# EAGLE design tmc5160_step (EAGLE 6.4)

## Sheet 1 of 5
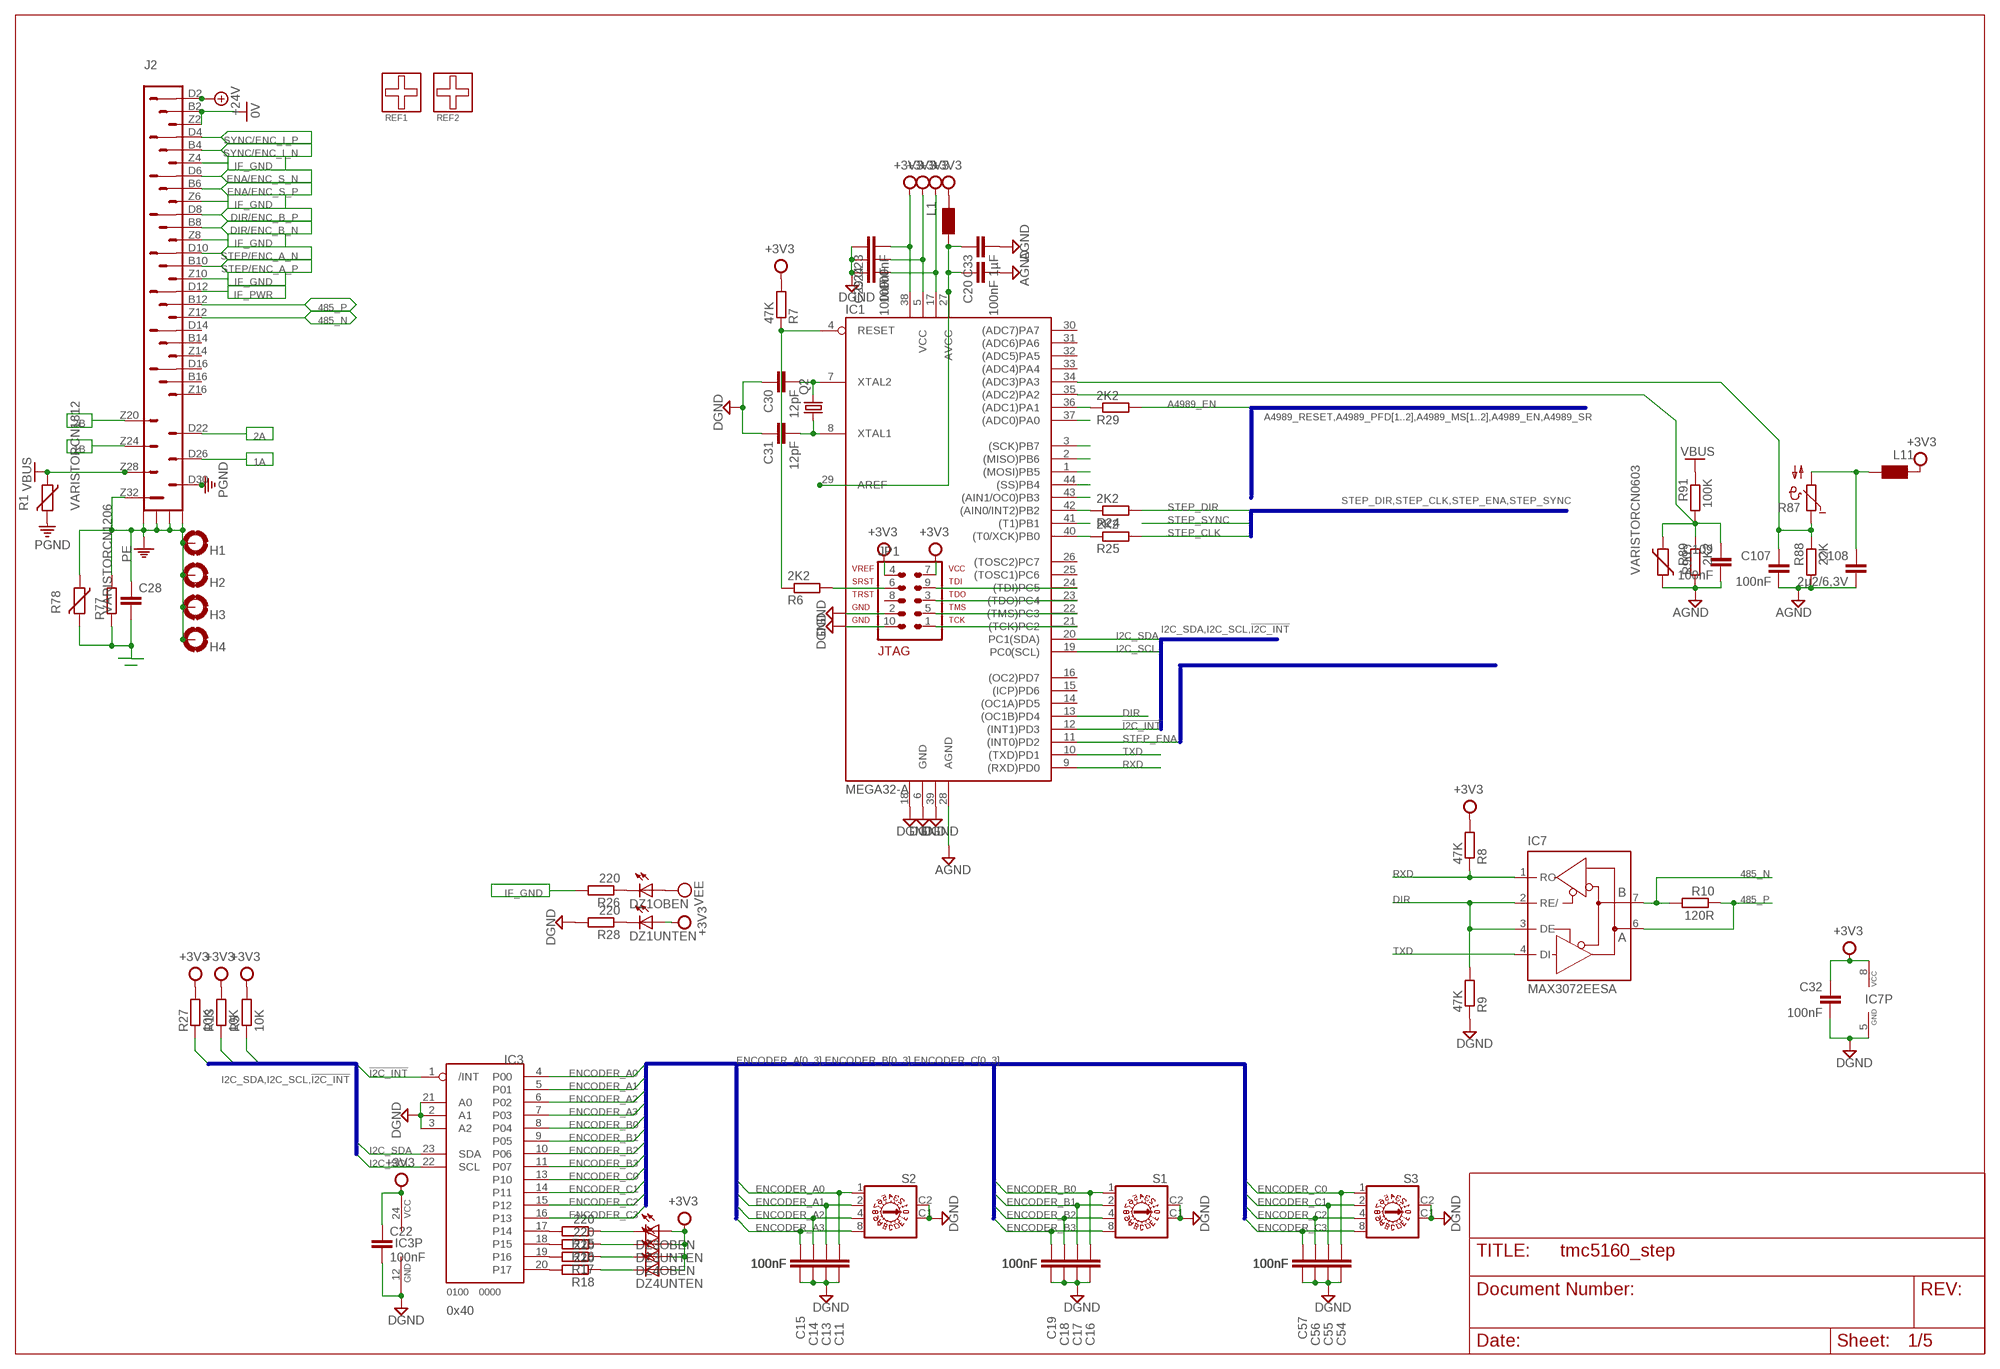
[diagram p0: schematic, sheet 1]

### Parts
C11  100nF  C-EUC0603  [C0603]
C13  100nF  C-EUC0603  [C0603]
C14  100nF  C-EUC0603  [C0603]
C15  100nF  C-EUC0603  [C0603]
C16  100nF  C-EUC0603  [C0603]
C17  100nF  C-EUC0603  [C0603]
C18  100nF  C-EUC0603  [C0603]
C19  100nF  C-EUC0603  [C0603]
C20  100nF  C-EUC0603  [C0603]
C22  100nF  C-EUC0603  [C0603]
C23  100nF  C-EUC0603  [C0603]
C24  100nF  C-EUC0603  [C0603]
C28  C-EUC1812  [C1812]
C29  100nF  C-EUC0603  [C0603]
C30  12pF  C-EUC0603  [C0603]
C31  12pF  C-EUC0603  [C0603]
C32  100nF  C-EUC0603  [C0603]
C33  1µF  C-EUC0603  [C0603]
C54  100nF  C-EUC0603  [C0603]
C55  100nF  C-EUC0603  [C0603]
C56  100nF  C-EUC0603  [C0603]
C57  100nF  C-EUC0603  [C0603]
C107  100nF  C-EUC0603  [C0603]
C108  2µ2/6,3V  C-EUC0603  [C0603]
C109  100nF  C-EUC0603  [C0603]
DZ1  18011801  [1801]
DZ3  18011801  [1801]
DZ4  18011801  [1801]
H1  MOUNT-PAD-ROUND2,5  [2,5-PAD]
H2  MOUNT-PAD-ROUND2,5  [2,5-PAD]
H3  MOUNT-PAD-ROUND2,5  [2,5-PAD]
H4  MOUNT-PAD-ROUND2,5  [2,5-PAD]
IC1  MEGA32-A  [TQFP44]
IC3  PCF8575  [MSSOP24]
IC7  MAX3072EESA  MAX481CSA  [SO08]
J2  H7/24L  [H7/24L_EK_FP]
JP1  AVR-JTAG-10-R  [AVR-JTAG-10R]
L1  WE-CBF_0805  [0805]
L11  WE-CBF_0805  [0805]
Q2  CRYSTALHC49S  [HC49/S]
R1  VARISTORCN1812  [CT/CN1812]
R5  10K  R-EU_R0603  [R0603]
R6  2K2  R-EU_R0603  [R0603]
R7  47K  R-EU_R0603  [R0603]
R8  47K  R-EU_R0603  [R0603]
R9  47K  R-EU_R0603  [R0603]
R10  120R  R-EU_R0603  [R0603]
R13  10K  R-EU_R0603  [R0603]
R15  220  R-EU_R0603  [R0603]
R16  220  R-EU_R0603  [R0603]
R17  220  R-EU_R0603  [R0603]
R18  220  R-EU_R0603  [R0603]
R24  2K2  R-EU_R0603  [R0603]
R25  2K2  R-EU_R0603  [R0603]
R26  220  R-EU_R0603  [R0603]
R27  10K  R-EU_R0603  [R0603]
R28  220  R-EU_R0603  [R0603]
R29  2K2  R-EU_R0603  [R0603]
R77  R-EU_R1206  [R1206]
R78  VARISTORCN1206  [CT/CN1206]
R87  NTC642-6  [P642]
R88  22K  R-EU_R0603  [R0603]
R89  2K2  R-EU_R0603  [R0603]
R90  VARISTORCN0603  [CT/CN0603]
R91  100K  R-EU_R0603  [R0603]
REF1  FIDUCIAL_REF-DRUCK  [REF-DRUCK]
REF2  FIDUCIAL_REF-DRUCK  [REF-DRUCK]
S1  COPAL_HEX  [COPAL_HEX]
S2  COPAL_HEX  [COPAL_HEX]
S3  COPAL_HEX  [COPAL_HEX]

### Nets
0V: J2.B2 J2.Z2 ; also sheet 2
1A: J2.D26 ; also sheet 3
1B: J2.Z24 ; also sheet 3
2A: J2.D22 ; also sheet 3
2B: J2.Z20 ; also sheet 3
485_N [diff]: IC7.7(B) J2.Z12 R10.2
485_P [diff]: IC7.6(A) J2.B12 R10.1
!I2C_INT: IC1.12((INT1)PD3) IC3.1(/INT) R5.1
+3V3: C22.1 C23.2 C24.2 C29.2 C32.1 DZ1.UA(UNTEN:A) DZ3.OA(OBEN:A) DZ3.UA(UNTEN:A) DZ4.OA(OBEN:A) DZ4.UA(UNTEN:A) IC1.5(VCC) IC1.17(VCC1) IC1.38(VCC2) IC3.24(VCC) IC7.8(VCC) JP1.4 JP1.7 L1.1 L11.1 R5.2 R7.2 R8.2 R13.2 R27.2 ; also sheet 2,3,4,5
+24V: J2.D2 ; also sheet 2
A4989_EN: R29.2 ; also sheet 3
AGND: C20.2 C33.2 C107.2 C108.2 C109.2 IC1.28(AGND) R88.2 R89.2 R90.2 ; also sheet 2
DGND: C11.1 C13.1 C14.1 C15.1 C16.1 C17.1 C18.1 C19.1 C22.2 C23.1 C24.1 C29.1 C30.1 C31.1 C32.2 C54.1 C55.1 C56.1 C57.1 IC1.6(GND) IC1.18(GND1) IC1.39(GND2) IC3.2(A1) IC3.3(A2) IC3.12(GND) IC3.21(A0) IC7.5(GND) JP1.2 JP1.10 R9.1 R28.2 S1.C1 S1.C2 S2.C1 S2.C2 S3.C1 S3.C2 ; also sheet 2,3,4,5
DIR: IC1.13((OC1B)PD4) IC7.2(RE/) IC7.3(DE) R9.2
DIR/ENC_B_N [diff]: J2.B8 ; also sheet 4
DIR/ENC_B_P [diff]: J2.D8 ; also sheet 4
ENA/ENC_S_N [diff]: J2.D6 ; also sheet 4
ENA/ENC_S_P [diff]: J2.B6 ; also sheet 4
ENCODER_A0: C11.2 IC3.4(P00) S2.1
ENCODER_A1: C13.2 IC3.5(P01) S2.2
ENCODER_A2: C14.2 IC3.6(P02) S2.4
ENCODER_A3: C15.2 IC3.7(P03) S2.8
ENCODER_B0: C16.2 IC3.8(P04) S1.1
ENCODER_B1: C17.2 IC3.9(P05) S1.2
ENCODER_B2: C18.2 IC3.10(P06) S1.4
ENCODER_B3: C19.2 IC3.11(P07) S1.8
ENCODER_C0: C54.2 IC3.13(P10) S3.1
ENCODER_C1: C55.2 IC3.14(P11) S3.2
ENCODER_C2: C56.2 IC3.15(P12) S3.4
ENCODER_C3: C57.2 IC3.16(P13) S3.8
I2C_SCL: IC1.19(PC0(SCL)) IC3.22(SCL) R27.1
I2C_SDA: IC1.20(PC1(SDA)) IC3.23(SDA) R13.1
IF_GND: J2.Z4 J2.Z6 J2.Z8 J2.Z10 R26.2 ; also sheet 4
IF_PWR: J2.D12 ; also sheet 4
N$13: JP1.6 R6.2
N$14: IC1.4(RESET) R6.1 R7.1
N$15: C107.1 IC1.34((ADC3)PA3) R87.1 R88.1
N$16: IC1.21((TCK)PC2) JP1.1
N$17: IC1.22((TMS)PC3) JP1.5
N$18: IC1.23((TDO)PC4) JP1.3
N$19: IC1.24((TDI)PC5) JP1.9
N$20: C20.1 C33.1 IC1.27(AVCC) IC1.29(AREF) L1.2
N$23: C30.2 IC1.7(XTAL2) Q2.2
N$24: C31.2 IC1.8(XTAL1) Q2.1
N$26: DZ3.OK(OBEN:C) R15.1
N$27: DZ3.UK(UNTEN:C) R16.1
N$28: DZ4.OK(OBEN:C) R17.1
N$29: DZ4.UK(UNTEN:C) R18.1
N$30: IC3.17(P14) R15.2
N$31: IC3.18(P15) R16.2
N$32: IC3.19(P16) R17.2
N$33: IC3.20(P17) R18.2
N$42: IC1.43((AIN1/OC0)PB3)
N$45: IC1.3((SCK)PB7)
N$46: IC1.1((MOSI)PB5)
N$49: IC1.44((SS)PB4)
N$50: IC1.2((MISO)PB6)
N$51: IC1.41((T1)PB1)
N$52: IC1.42((AIN0/INT2)PB2) R24.1
N$56: IC1.40((T0/XCK)PB0) R25.1
N$57: DZ1.OK(OBEN:C) R26.1
N$60: DZ1.UK(UNTEN:C) R28.1
N$61: IC1.36((ADC1)PA1) R29.1
N$62: IC1.37((ADC0)PA0)
N$82: C108.1 L11.2 R87.2
N$87: C109.1 IC1.35((ADC2)PA2) R89.1 R90.1 R91.2
PE: C28.1 H1.B2,5(MOUNT) H2.B2,5(MOUNT) H3.B2,5(MOUNT) H4.B2,5(MOUNT) J2.S1 J2.S2 J2.S3 J2.S4 J2.Z32 R77.2 R78.1 ; also sheet 4
PGND: J2.D30 R1.2 ; also sheet 3
RXD: IC1.9((RXD)PD0) IC7.1(RO) R8.1
SGND: C28.2 R77.1 R78.2 ; also sheet 2
STEP/ENC_A_N [diff]: J2.D10 ; also sheet 4
STEP/ENC_A_P [diff]: J2.B10 ; also sheet 4
STEP_CLK: R25.2 ; also sheet 3,4
STEP_DIR: R24.2 ; also sheet 3,4
STEP_ENA: IC1.11((INT0)PD2) ; also sheet 4
SYNC/ENC_I_N [diff]: J2.B4 ; also sheet 4
SYNC/ENC_I_P [diff]: J2.D4 ; also sheet 4
TXD: IC1.10((TXD)PD1) IC7.4(DI)
VBUS: J2.Z28 R1.1 R91.1 ; also sheet 3
VEE: DZ1.OA(OBEN:A) ; also sheet 4
Unconnected: IC1.14((OC1A)PD5) IC1.15((ICP)PD6) IC1.16((OC2)PD7) IC1.25((TOSC1)PC6) IC1.26((TOSC2)PC7) IC1.30((ADC7)PA7) IC1.31((ADC6)PA6) IC1.32((ADC5)PA5) IC1.33((ADC4)PA4) J2.B14 J2.B16 J2.D14 J2.D16 J2.Z14 J2.Z16 JP1.8 REF1.P$1 REF2.P$1

### Buses
ENCODER_A[0..3],ENCODER_B[0..3],ENCODER_C[0..3]
I2C_SDA,I2C_SCL,!I2C_INT
A4989_RESET,A4989_PFD[1..2],A4989_MS[1..2],A4989_EN,A4989_SR
STEP_DIR,STEP_CLK,STEP_ENA,STEP_SYNC

### Notes on the sheet
- 0100 | 0000
- 0x40

## Sheet 2 of 5
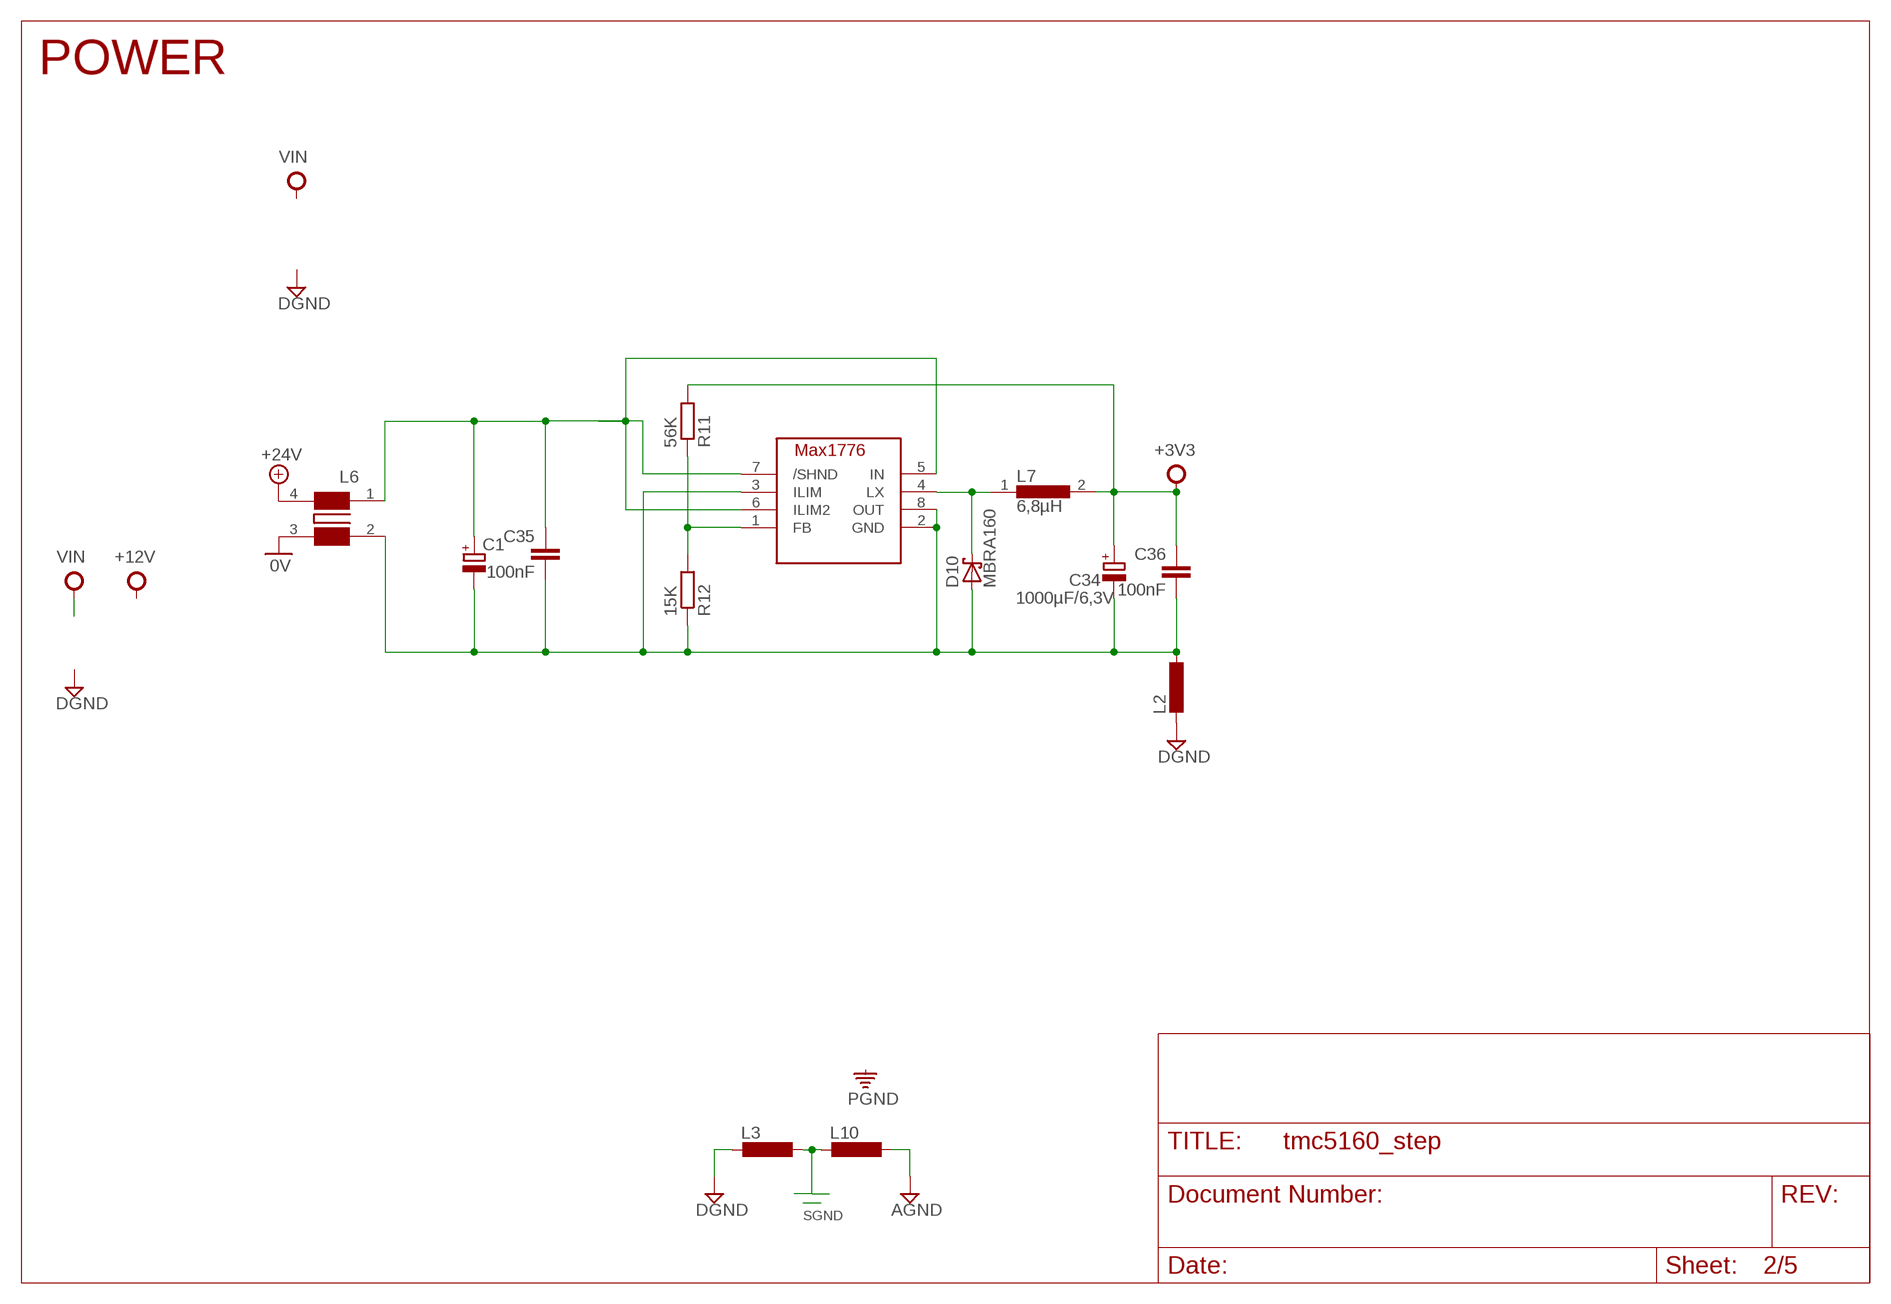
[diagram p1: schematic, sheet 2]

### Parts
C1  CPOL-EUE3.5-8  [E3,5-8]
C34  1000µF/6,3V  CPOL-EUE3.5-8  [E3,5-8]
C35  100nF  C-EUC0603  [C0603]
C36  100nF  C-EUC0603  [C0603]
D10  MBRA160  SCHOTTKY-DIODESMD  [SMB]
IC8  MAX1776  [UMAX8]
L2  L-EUL2825P  [L2825P]
L3  L-EUL2825P  [L2825P]
L6  WE-CMS  [WE-CMS_7427521]
L7  6,8µH  B82464-G4-03-5976B82472  [B82472]
L10  L-EUL2825P  [L2825P]
R11  56K  R-EU_R0603  [R0603]
R12  15K  R-EU_R0603  [R0603]

### Nets
0V: L6.3 ; also sheet 1
+3V3: C34.+ C36.1 L7.2 R11.2 ; also sheet 1,3,4,5
+24V: L6.4 ; also sheet 1
AGND: L10.1 ; also sheet 1
DGND: L2.2 L3.2 ; also sheet 1,3,4,5
N$40: D10.C IC8.4(LX) L7.1
N$41: IC8.1(FB) R11.1 R12.2
N$63: C1.+ C35.1 IC8.5(IN) IC8.6(ILIM2) IC8.7(/SHND) L6.1
N$64: C1.- C34.- C35.2 C36.2 D10.A IC8.2(GND) IC8.3(ILIM) IC8.8(OUT) L2.1 L6.2 R12.1
SGND: L3.1 L10.2 ; also sheet 1

### Notes on the sheet
- POWER

## Sheet 3 of 5
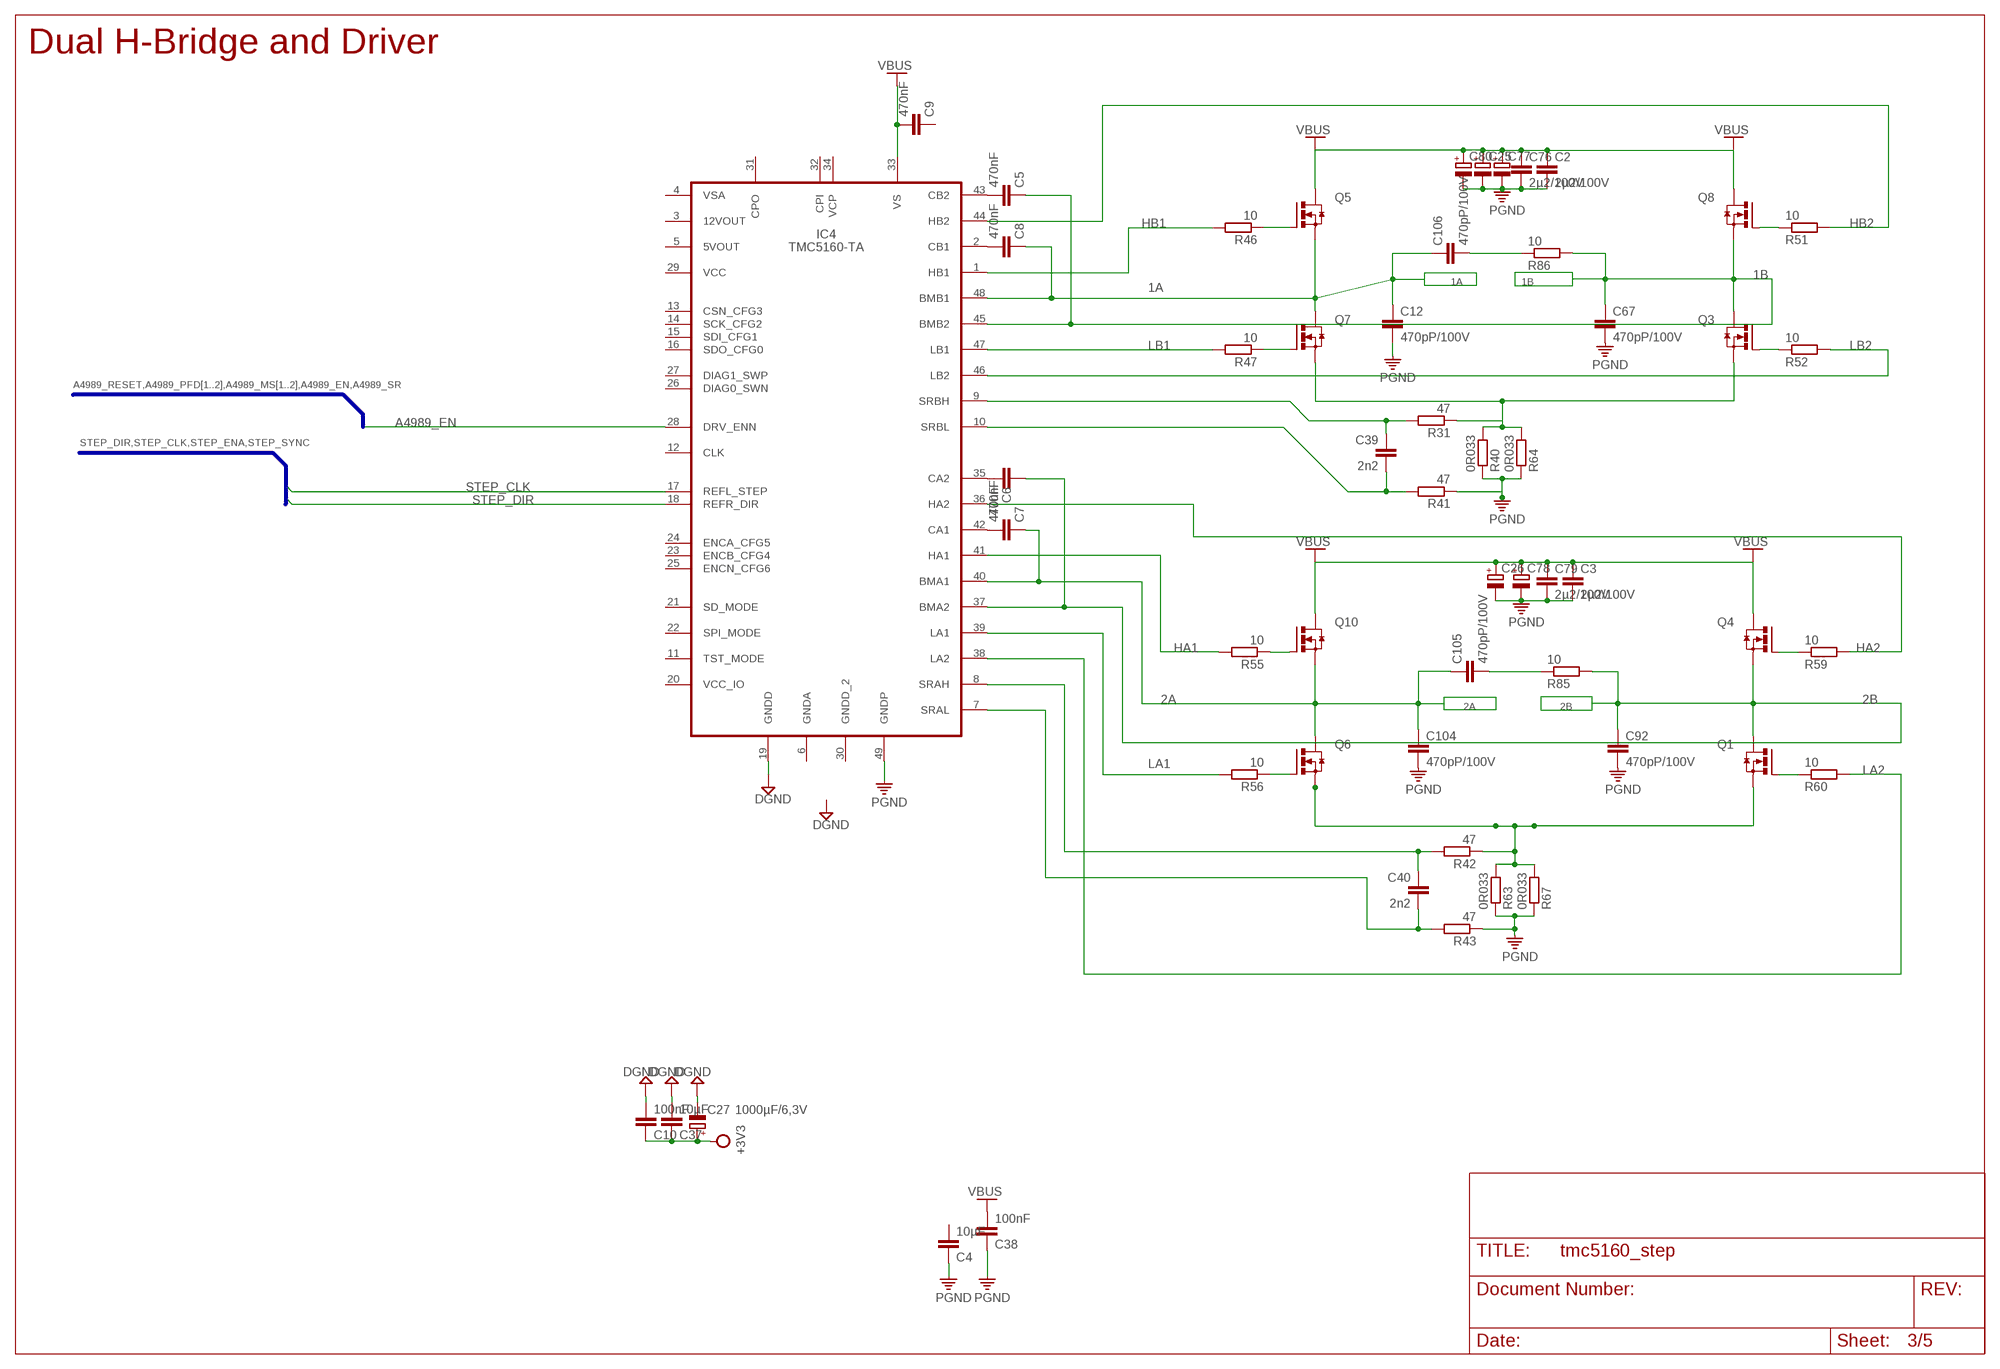
[diagram p2: schematic, sheet 3]

### Parts
C2  2µ2/100V  C-EUC1812  [C1812]
C3  2µ2/100V  C-EUC1812  [C1812]
C4  10µF  C-EUC1206  [C1206]
C5  470nF  C-EUC0603  [C0603]
C6  470nF  C-EUC0603  [C0603]
C7  470nF  C-EUC0603  [C0603]
C8  470nF  C-EUC0603  [C0603]
C9  470nF  C-EUC0603  [C0603]
C10  100nF  C-EUC0603  [C0603]
C12  470pP/100V  C-EUC1210  [C1210]
C25  CPOL-EUE5-10.5  [E5-10,5]
C26  CPOL-EUE5-10.5  [E5-10,5]
C27  1000µF/6,3V  CPOL-EUE2.5-6  [E2,5-6]
C37  10µF  C-EUC0805  [C0805]
C38  100nF  C-EUC0603  [C0603]
C39  2n2  C-EUC0603  [C0603]
C40  2n2  C-EUC0603  [C0603]
C67  470pP/100V  C-EUC1210  [C1210]
C76  2µ2/100V  C-EUC1812  [C1812]
C77  CPOL-EUE5-10.5  [E5-10,5]
C78  CPOL-EUE5-10.5  [E5-10,5]
C79  2µ2/100V  C-EUC1812  [C1812]
C80  CPOL-EUE5-10.5  [E5-10,5]
C92  470pP/100V  C-EUC1210  [C1210]
C104  470pP/100V  C-EUC1210  [C1210]
C105  470pP/100V  C-EUC1210  [C1210]
C106  470pP/100V  C-EUC1210  [C1210]
IC4  TMC5160-TA  TMC5160-TA  [TQFP48-EP]
Q1  SUD40N10  [D-PAK_TO252AA]
Q3  SUD40N10  [D-PAK_TO252AA]
Q4  SUD40N10  [D-PAK_TO252AA]
Q5  SUD40N10  [D-PAK_TO252AA]
Q6  SUD40N10  [D-PAK_TO252AA]
Q7  SUD40N10  [D-PAK_TO252AA]
Q8  SUD40N10  [D-PAK_TO252AA]
Q10  SUD40N10  [D-PAK_TO252AA]
R31  47  R-EU_R0603  [R0603]
R40  0R033  R-EU_R2512  [R2512]
R41  47  R-EU_R0603  [R0603]
R42  47  R-EU_R0603  [R0603]
R43  47  R-EU_R0603  [R0603]
R46  10  R-EU_R0603  [R0603]
R47  10  R-EU_R0603  [R0603]
R51  10  R-EU_R0603  [R0603]
R52  10  R-EU_R0603  [R0603]
R55  10  R-EU_R0603  [R0603]
R56  10  R-EU_R0603  [R0603]
R59  10  R-EU_R0603  [R0603]
R60  10  R-EU_R0603  [R0603]
R63  0R033  R-EU_R2512  [R2512]
R64  0R033  R-EU_R2512  [R2512]
R67  0R033  R-EU_R2512  [R2512]
R85  10  R-EU_R1206  [R1206]
R86  10  R-EU_R1206  [R1206]

### Nets
1A: C8.1 C12.1 C106.1 IC4.48(BMB1) Q5.3(S) Q7.4(D) ; also sheet 1
1B: C5.1 C67.1 IC4.45(BMB2) Q3.4(D) Q8.3(S) R86.2 ; also sheet 1
2A: C7.1 C104.1 C105.1 IC4.40(BMA1) Q6.4(D) Q10.3(S) ; also sheet 1
2B: C6.1 C92.1 IC4.37(BMA2) Q1.4(D) Q4.3(S) R85.2 ; also sheet 1
+3V3: C10.1 C27.+ C37.1 ; also sheet 1,2,4,5
A4989_EN: IC4.28(DRV_ENN) ; also sheet 1
DGND: C10.2 C27.- C37.2 IC4.19(GNDD) ; also sheet 1,2,4,5
HA1: IC4.41(HA1) R55.2
HA2: IC4.36(HA2) R59.2
HB1: IC4.1(HB1) R46.2
HB2: IC4.44(HB2) R51.2
LA1: IC4.39(LA1) R56.2
LA2: IC4.38(LA2) R60.2
LB1: IC4.47(LB1) R47.2
LB2: IC4.46(LB2) R52.2
N$2: C5.2 IC4.43(CB2)
N$4: C39.1 IC4.9(SRBH) R31.2
N$5: C39.2 IC4.10(SRBL) R41.2
N$7: C8.2 IC4.2(CB1)
N$8: C7.2 IC4.42(CA1)
N$9: C6.2 IC4.35(CA2)
N$10: C40.1 IC4.8(SRAH) R42.2
N$11: C40.2 IC4.7(SRAL) R43.2
N$37: Q5.1(G) R46.1
N$38: Q7.1(G) R47.1
N$47: Q3.1(G) R52.1
N$48: Q8.1(G) R51.1
N$69: Q10.1(G) R55.1
N$70: Q6.1(G) R56.1
N$76: Q1.1(G) R60.1
N$77: Q4.1(G) R59.1
N$79: C105.2 R85.1
N$86: C106.2 R86.1
PGND: C2.2 C3.2 C4.1 C12.2 C25.- C26.- C38.1 C67.2 C76.2 C77.- C78.- C79.2 C80.- C92.2 C104.2 IC4.49(GNDP) R40.1 R41.1 R43.1 R63.1 R64.1 R67.1 ; also sheet 1
SENSE1: Q3.3(S) Q7.3(S) R31.1 R40.2 R64.2
SENSE2: Q1.3(S) Q6.3(S) R42.1 R63.2 R67.2
STEP_CLK: IC4.17(REFL_STEP) ; also sheet 1,4
STEP_DIR: IC4.18(REFR_DIR) ; also sheet 1,4
VBUS: C2.1 C3.1 C9.2 C25.+ C26.+ C38.2 C76.1 C77.+ C78.+ C79.1 C80.+ IC4.33(VS) Q4.4(D) Q5.4(D) Q8.4(D) Q10.4(D) ; also sheet 1
Unconnected: C4.2 C9.1 IC4.3(12VOUT) IC4.5(5VOUT) IC4.11(TST_MODE) IC4.12(CLK) IC4.13(CSN_CFG3) IC4.14(SCK_CFG2) IC4.15(SDI_CFG1) IC4.16(SDO_CFG0) IC4.21(SD_MODE) IC4.22(SPI_MODE) IC4.23(ENCB_CFG4) IC4.24(ENCA_CFG5) IC4.25(ENCN_CFG6) IC4.26(DIAG0_SWN) IC4.27(DIAG1_SWP) IC4.31(CPO) IC4.32(CPI) IC4.34(VCP)

### Buses
STEP_DIR,STEP_CLK,STEP_ENA,STEP_SYNC
A4989_RESET,A4989_PFD[1..2],A4989_MS[1..2],A4989_EN,A4989_SR

### Notes on the sheet
- Dual H-Bridge and Driver

## Sheet 4 of 5
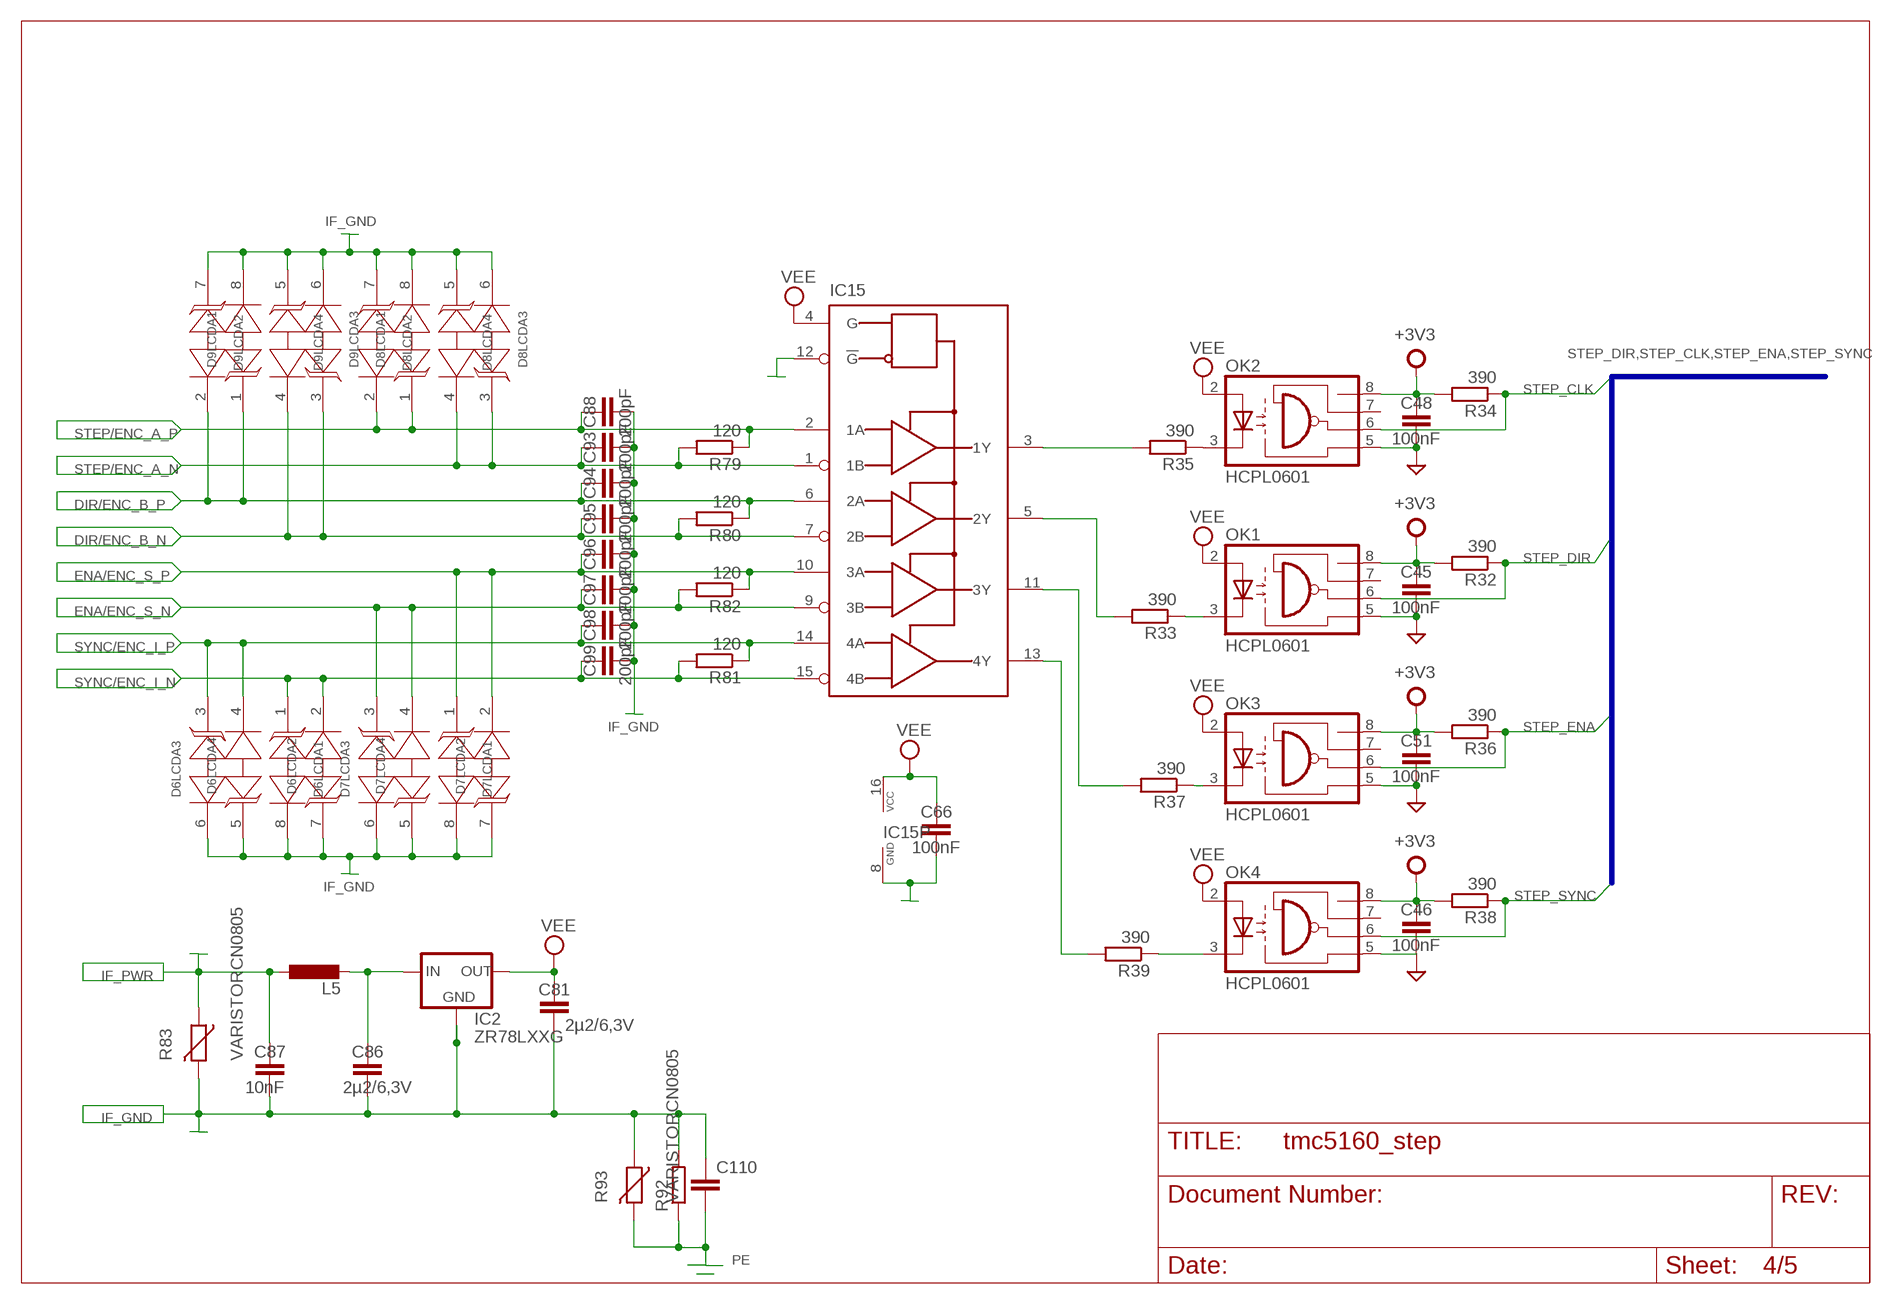
[diagram p3: schematic, sheet 4]

### Parts
C45  100nF  C-EUC0603  [C0603]
C46  100nF  C-EUC0603  [C0603]
C48  100nF  C-EUC0603  [C0603]
C51  100nF  C-EUC0603  [C0603]
C66  100nF  C-EUC0603  [C0603]
C81  2µ2/6,3V  C-EUC1210  [C1210]
C86  2µ2/6,3V  C-EUC0603  [C0603]
C87  10nF  C-EUC0603  [C0603]
C88  200pF  C-EUC0603  [C0603]
C93  200pF  C-EUC0603  [C0603]
C94  200pF  C-EUC0603  [C0603]
C95  200pF  C-EUC0603  [C0603]
C96  200pF  C-EUC0603  [C0603]
C97  200pF  C-EUC0603  [C0603]
C98  200pF  C-EUC0603  [C0603]
C99  200pF  C-EUC0603  [C0603]
C110  C-EUC1206  [C1206]
D6  LCDAXXSO08  [SO08]
D7  LCDAXXSO08  [SO08]
D8  LCDAXXSO08  [SO08]
D9  LCDAXXSO08  [SO08]
IC2  ZR78LXXG  [SO223G]
IC15  AM26LV32  [SO-16]
L5  L-EUL2825P  [L2825P]
OK1  HCPL0601  [SOIC08]
OK2  HCPL0601  [SOIC08]
OK3  HCPL0601  [SOIC08]
OK4  HCPL0601  [SOIC08]
R32  390  R-EU_R0603  [R0603]
R33  390  R-EU_R0603  [R0603]
R34  390  R-EU_R0603  [R0603]
R35  390  R-EU_R0603  [R0603]
R36  390  R-EU_R0603  [R0603]
R37  390  R-EU_R0603  [R0603]
R38  390  R-EU_R0603  [R0603]
R39  390  R-EU_R0603  [R0603]
R79  120  R-EU_R0603  [R0603]
R80  120  R-EU_R0603  [R0603]
R81  120  R-EU_R0603  [R0603]
R82  120  R-EU_R0603  [R0603]
R83  VARISTORCN0805  [CT/CN0805]
R92  R-EU_R1206  [R1206]
R93  VARISTORCN0805  [CT/CN0805]

### Nets
+3V3: C45.1 C46.1 C48.1 C51.1 OK1.8(VCC) OK2.8(VCC) OK3.8(VCC) OK4.8(VCC) R32.2 R34.2 R36.2 R38.2 ; also sheet 1,2,3,5
DGND: C45.2 C46.2 C48.2 C51.2 OK1.5(GND) OK2.5(GND) OK3.5(GND) OK4.5(GND) ; also sheet 1,2,3,5
DIR/ENC_B_N [diff]: C95.1 D9.3 D9.4 IC15.7(2B) R80.2 ; also sheet 1
DIR/ENC_B_P [diff]: C94.1 D9.1 D9.2 IC15.6(2A) R80.1 ; also sheet 1
ENA/ENC_S_N [diff]: C97.1 D7.3 D7.4 IC15.9(3B) R82.2 ; also sheet 1
ENA/ENC_S_P [diff]: C96.1 D7.1 D7.2 IC15.10(3A) R82.1 ; also sheet 1
IF_GND: C66.2 C81.2 C86.2 C87.2 C88.2 C93.2 C94.2 C95.2 C96.2 C97.2 C98.2 C99.2 C110.1 D6.5 D6.6 D6.7 D6.8 D7.5 D7.6 D7.7 D7.8 D8.5 D8.6 D8.7 D8.8 D9.5 D9.6 D9.7 D9.8 IC2.2(GND) IC2.4(GND1) IC15.8(GND) IC15.12(!G) R83.2 R92.2 R93.1 ; also sheet 1
IF_PWR: C87.1 L5.1 R83.1 ; also sheet 1
IN_DIR/ENC_B: IC15.5(2Y) R33.2
IN_ENA/ENC_S: IC15.11(3Y) R37.2
IN_STEP/ENC_A: IC15.3(1Y) R35.2
IN_SYNC/ENC_I: IC15.13(4Y) R39.2
N$6: C86.1 IC2.3(IN) L5.2
N$22: OK1.3(C) R33.1
N$25: OK4.3(C) R39.1
N$34: OK2.3(C) R35.1
N$35: OK3.3(C) R37.1
PE: C110.2 R92.1 R93.2 ; also sheet 1
STEP/ENC_A_N [diff]: C93.1 D8.3 D8.4 IC15.1(1B) R79.2 ; also sheet 1
STEP/ENC_A_P [diff]: C88.1 D8.1 D8.2 IC15.2(1A) R79.1 ; also sheet 1
STEP_CLK: OK2.6(VO) R34.1 ; also sheet 1,3
STEP_DIR: OK1.6(VO) R32.1 ; also sheet 1,3
STEP_ENA: OK3.6(VO) R36.1 ; also sheet 1
STEP_SYNC: OK4.6(VO) R38.1 ; also sheet 1
SYNC/ENC_I_N [diff]: C99.1 D6.1 D6.2 IC15.15(4B) R81.2 ; also sheet 1
SYNC/ENC_I_P [diff]: C98.1 D6.3 D6.4 IC15.14(4A) R81.1 ; also sheet 1
VEE: C66.1 C81.1 IC2.1(OUT) IC15.4(G) IC15.16(VCC) OK1.2(A) OK2.2(A) OK3.2(A) OK4.2(A) ; also sheet 1
Unconnected: OK1.7(VE) OK2.7(VE) OK3.7(VE) OK4.7(VE)

### Buses
STEP_DIR,STEP_CLK,STEP_ENA,STEP_SYNC

## Sheet 5 of 5
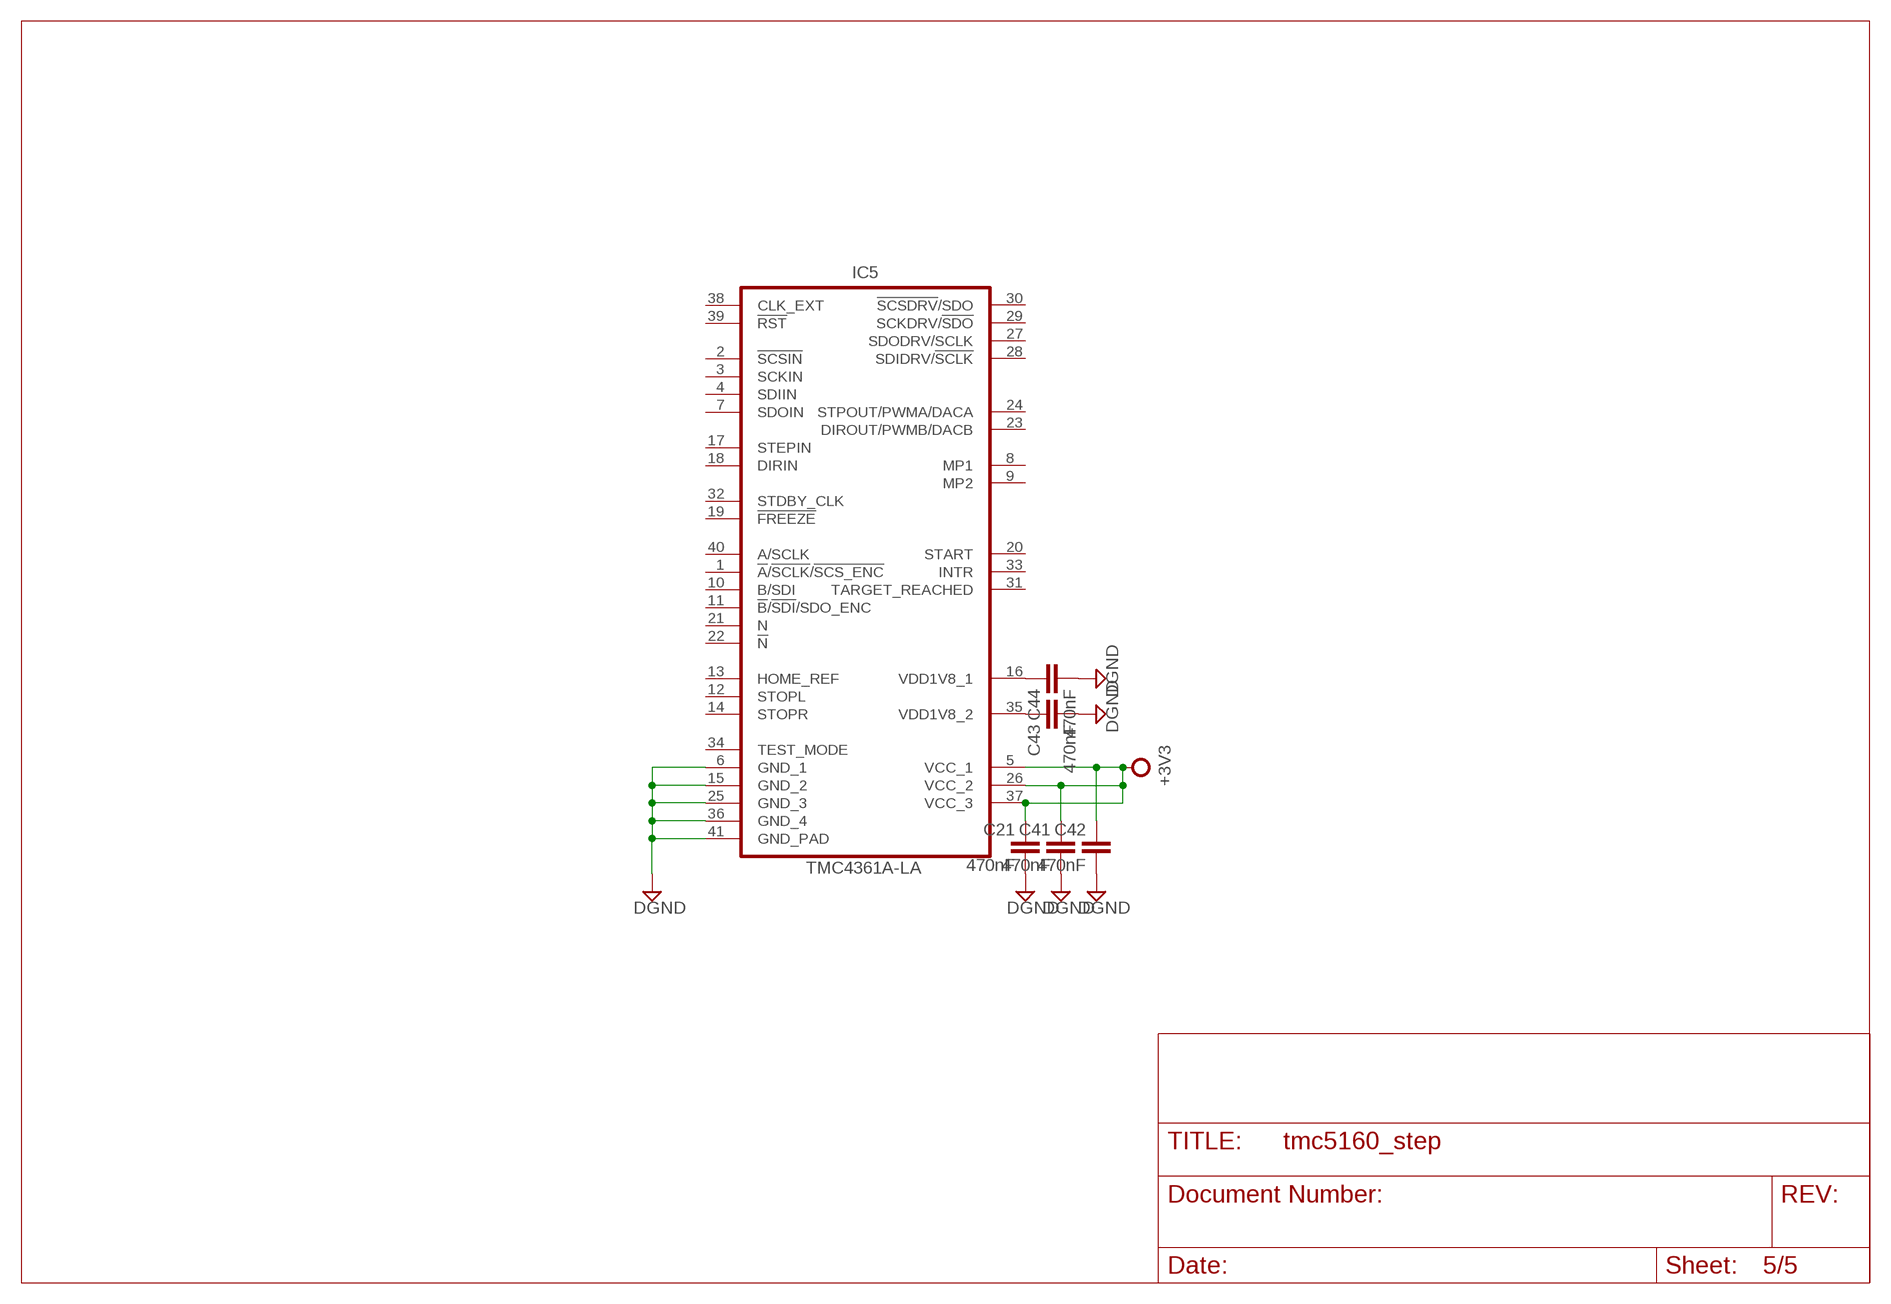
[diagram p4: schematic, sheet 5]

### Parts
C21  470nF  C-EUC0603  [C0603]
C41  470nF  C-EUC0603  [C0603]
C42  470nF  C-EUC0603  [C0603]
C43  470nF  C-EUC0603  [C0603]
C44  470nF  C-EUC0603  [C0603]
IC5  TMC4361A-LA  TMC4361A-LA  [TMC_QFN40_0.5_6.0X6.0]

### Nets
+3V3: C21.1 C41.1 C42.1 IC5.5(VCC_1) IC5.26(VCC_2) IC5.37(VCC_3) ; also sheet 1,2,3,4
DGND: C21.2 C41.2 C42.2 C43.2 C44.2 IC5.6(GND_1) IC5.15(GND_2) IC5.25(GND_3) IC5.36(GND_4) IC5.41(GND_PAD) ; also sheet 1,2,3,4
N$12: C43.1 IC5.35(VDD1V8_2)
N$21: C44.1 IC5.16(VDD1V8_1)
Unconnected: IC5.1(!A!/!SCLK!/!SCS_ENC) IC5.2(!SCSIN!) IC5.3(SCKIN) IC5.4(SDIIN) IC5.7(SDOIN) IC5.8(MP1) IC5.9(MP2) IC5.10(B/SDI) IC5.11(!B!/!SDI!/SDO_ENC) IC5.12(STOPL) IC5.13(HOME_REF) IC5.14(STOPR) IC5.17(STEPIN) IC5.18(DIRIN) IC5.19(!FREEZE!) IC5.20(START) IC5.21(N) IC5.22(!N!) IC5.23(DIROUT/PWMB/DACB) IC5.24(STPOUT/PWMA/DACA) IC5.27(SDODRV/SCLK) IC5.28(SDIDRV/!SCLK!) IC5.29(SCKDRV/!SDO!) IC5.30(!SCSDRV!/SDO) IC5.31(TARGET_REACHED) IC5.32(STDBY_CLK) IC5.33(INTR) IC5.34(TEST_MODE) IC5.38(CLK_EXT) IC5.39(!RST!) IC5.40(A/SCLK)

## Power pins joined to a net without a drawn wire
GNDA: IC4.6(GNDA)
GNDD_2: IC4.30(GNDD_2)
VCC: IC4.29(VCC)
VCC_IO: IC4.20(VCC_IO)
VSA: IC4.4(VSA)

## Library data of the parts
C1 C25-C27 C34 C77 C78 C80 = rcl:CPOL-EU: POLARIZED CAPACITOR, European symbol
C2-C21 C23 C24 C28-C33 C35-C44 C54-C57 C67 C76 C79 C92 C104-C110 = rcl:C-EU: CAPACITOR, European symbol
C22 C45 C46 C48 C51 C66 C81 C86-C88 C93-C99 = rcl-2:C-EU: CAPACITOR, European symbol
D6-D9 = diode:LCDAXX
D10 = diode:SCHOTTKY-DIODE: Schottky Diode
DZ1 DZ3 DZ4 = mentor_led:1801
H1-H4 = holes:MOUNT-PAD-ROUND: MOUNTING PAD, round
IC1 = atmel:MEGA32: MICROCONTROLLER 32 Kbytes FLASH 2 Kbytes SRAM 1 Kbytes EEPROM USART 8-channel 10 bit ADC
IC2 = v-reg-3:ZR78LXX: Zetex ZR78XXL Series
IC3 = M_SMD_IC:PCF8575
IC4 = TMC5160-TA:TMC5160-TA: Universal high voltage controller for two-phase bipolar stepper motor. TQFP48-EP; DESCRIPTION: Universal high voltage controller for two-phase bipolar stepper motor. TQFP48-EP; GEOMETRY_HEIGHT: 1.2mm; MANUFACTURER: TRINAMIC; ORDERCODE-MANU1: TMC5160-TA
IC5 = TMC4361A-LA:TMC4361A-LA: S-ramp motion controller for stepper motors with high velocities. With SPI and Step/Dir; QFN40(5x5); DESCRIPTION: S-ramp motion controller for stepper motors with high velocities_ With SPI and Step/Dir; QFN40(5x5); GEOMETRY_HEIGHT: 0_9mm; MANUFACTURER: TRINAMIC; ORDERCODE-MANU1: TMC4361A-LA
IC7 = maxim:MAX481CSA: RS485 TRANSEIVER
IC8 = maxim:MAX1776
IC15 = texas:AM26LV32: Differential Line Receiver
J2 = 19inch:H7/24L
JP1 = atmel:AVR-JTAG-10: AVR JTAG Debug/Programming Header
L1 L11 = wuerth-elektronik:WE-CBF: SMD EMI Suppression Ferrite Beads - excellent anti-EMI properties - low DCR - impedances till 3000 ohms - rated current up to 6 A
L2 L3 L5 L10 = rcl:L-EU: INDUCTOR, European symbol
L6 = wuerth_elektronik_v5:WE-CMS: Common Mode SMD Bead - rated current up to 5 A - impedances up to 200 ohms - RDC: 3 mohms
L7 = inductors:B82464-G4-03-5976: EPCOS-Inductor
OK1-OK4 = optocoupler:HCPL0601: HEWLETT PACKARD OPTO COUPLER; MF: AGILENT TECHNOLOGIES; MPN: HCPL-0601-000E; OC_FARNELL: 9995102; OC_NEWARK: 88H7776
Q1 Q3-Q8 Q10 = transistor-power:SUD40N10
Q2 = crystal:CRYSTAL: CRYSTAL; OC_FARNELL: 1667008; OC_NEWARK: unknown
R1 R78 R83 R90 R93 = varistor:VARISTOR: VARISTOR
R5-R13 R15-R18 R24-R29 R31-R43 R46 R47 R51 R52 R55 R56 R59 R60 R63 R64 R67 R79-R82 R85 R86 R88 R89 R91 = rcl-2:R-EU_: RESISTOR, European symbol
R77 R92 = rcl:R-EU_: RESISTOR, European symbol
R87 = ptc-ntc:NTC642-6: PHILIPS NTC; OC_FARNELL: unknown; OC_NEWARK: unknown
REF1 REF2 = Fiducial:FIDUCIAL
S1-S3 = switch-dil:COPAL_HEX

## Net classes
1 diff: width 0.203 mm, drill 0.152 mm, clearance 0.305 mm

## Board
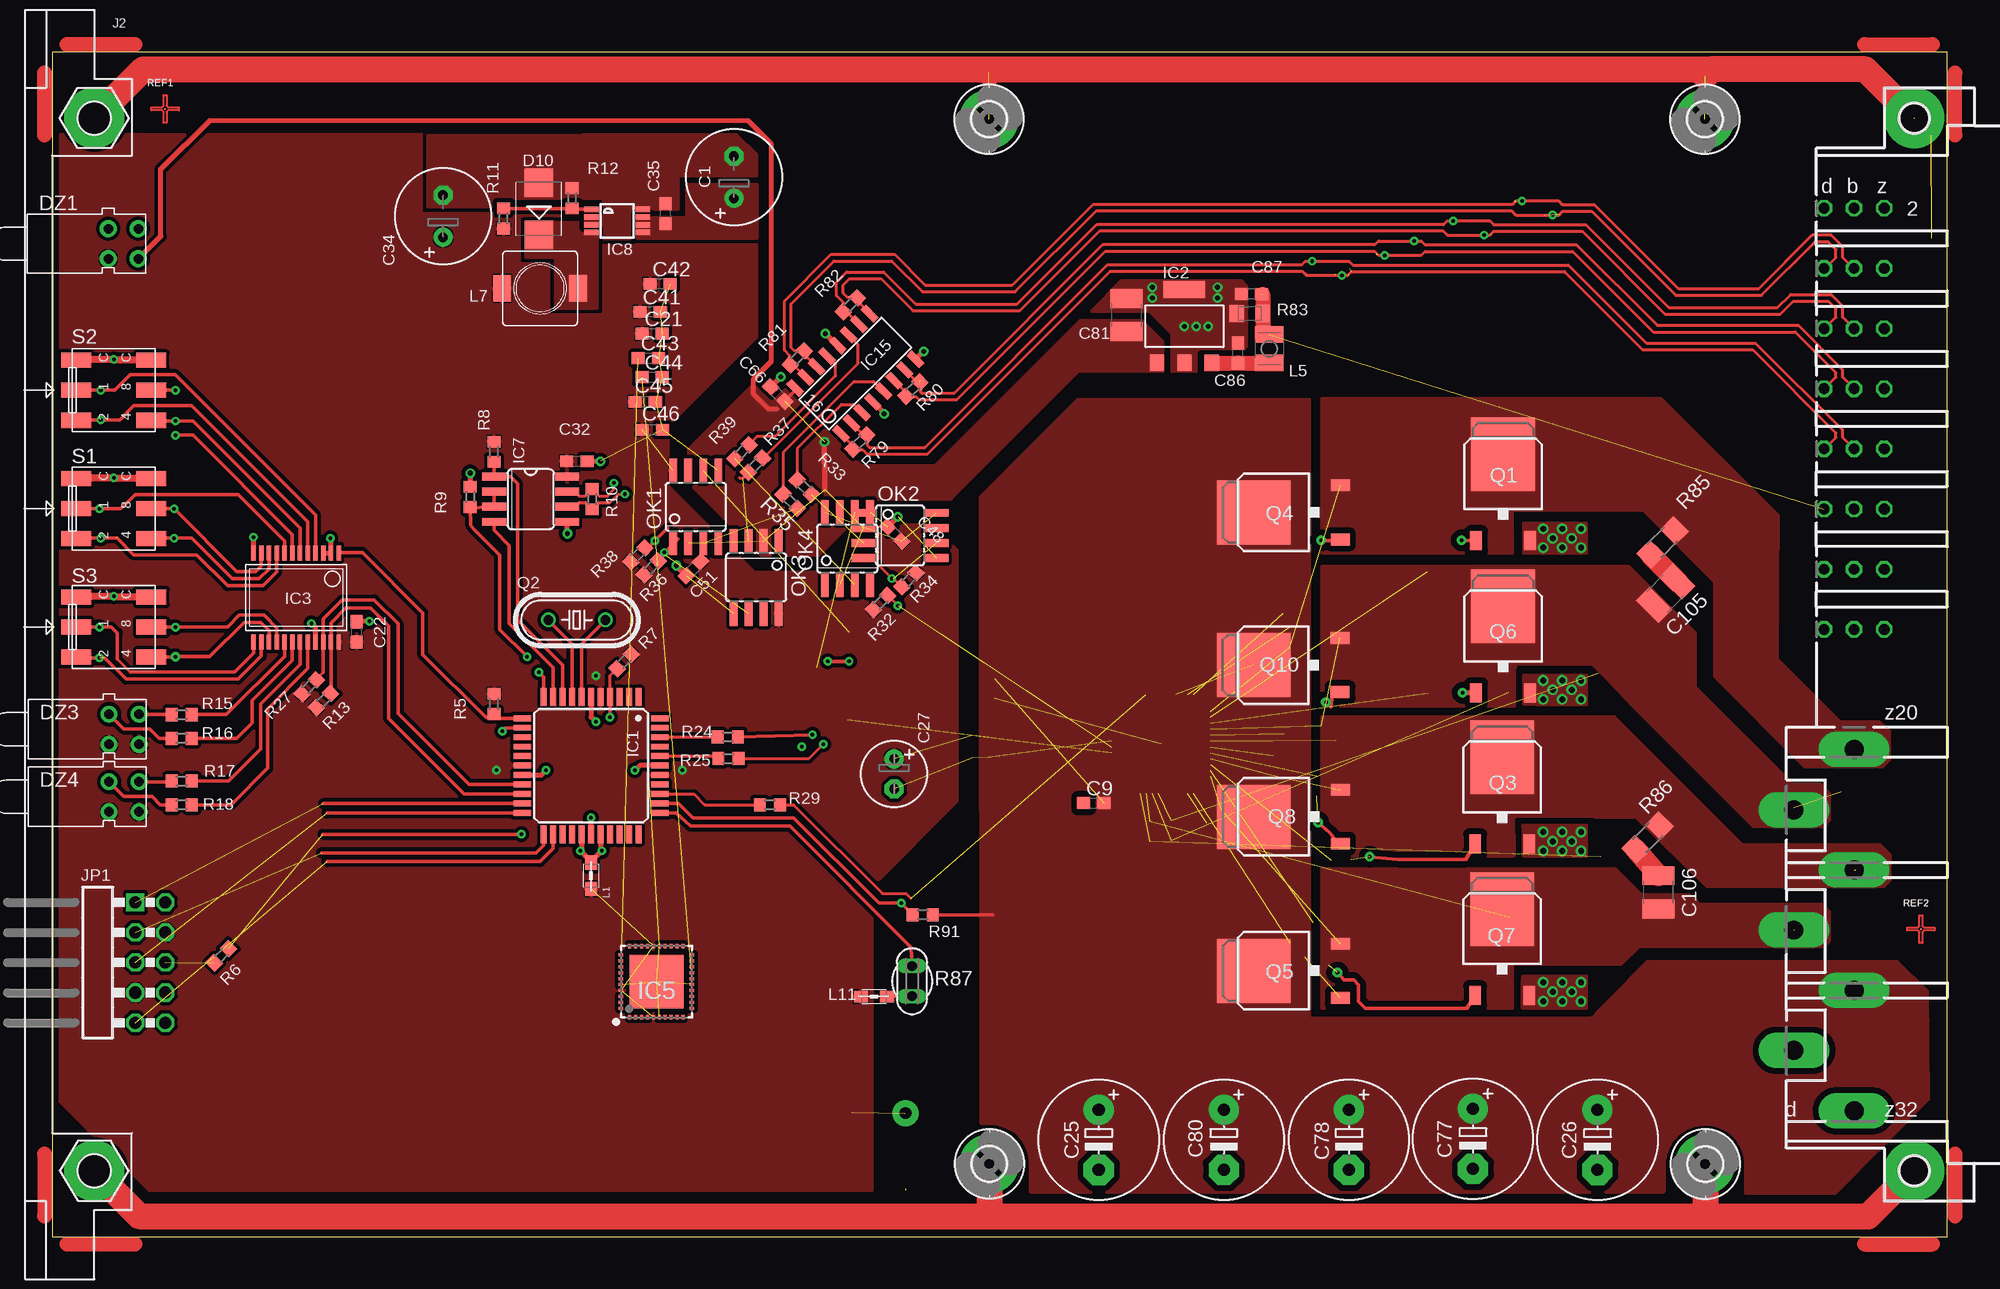
[diagram p5: board, top side]
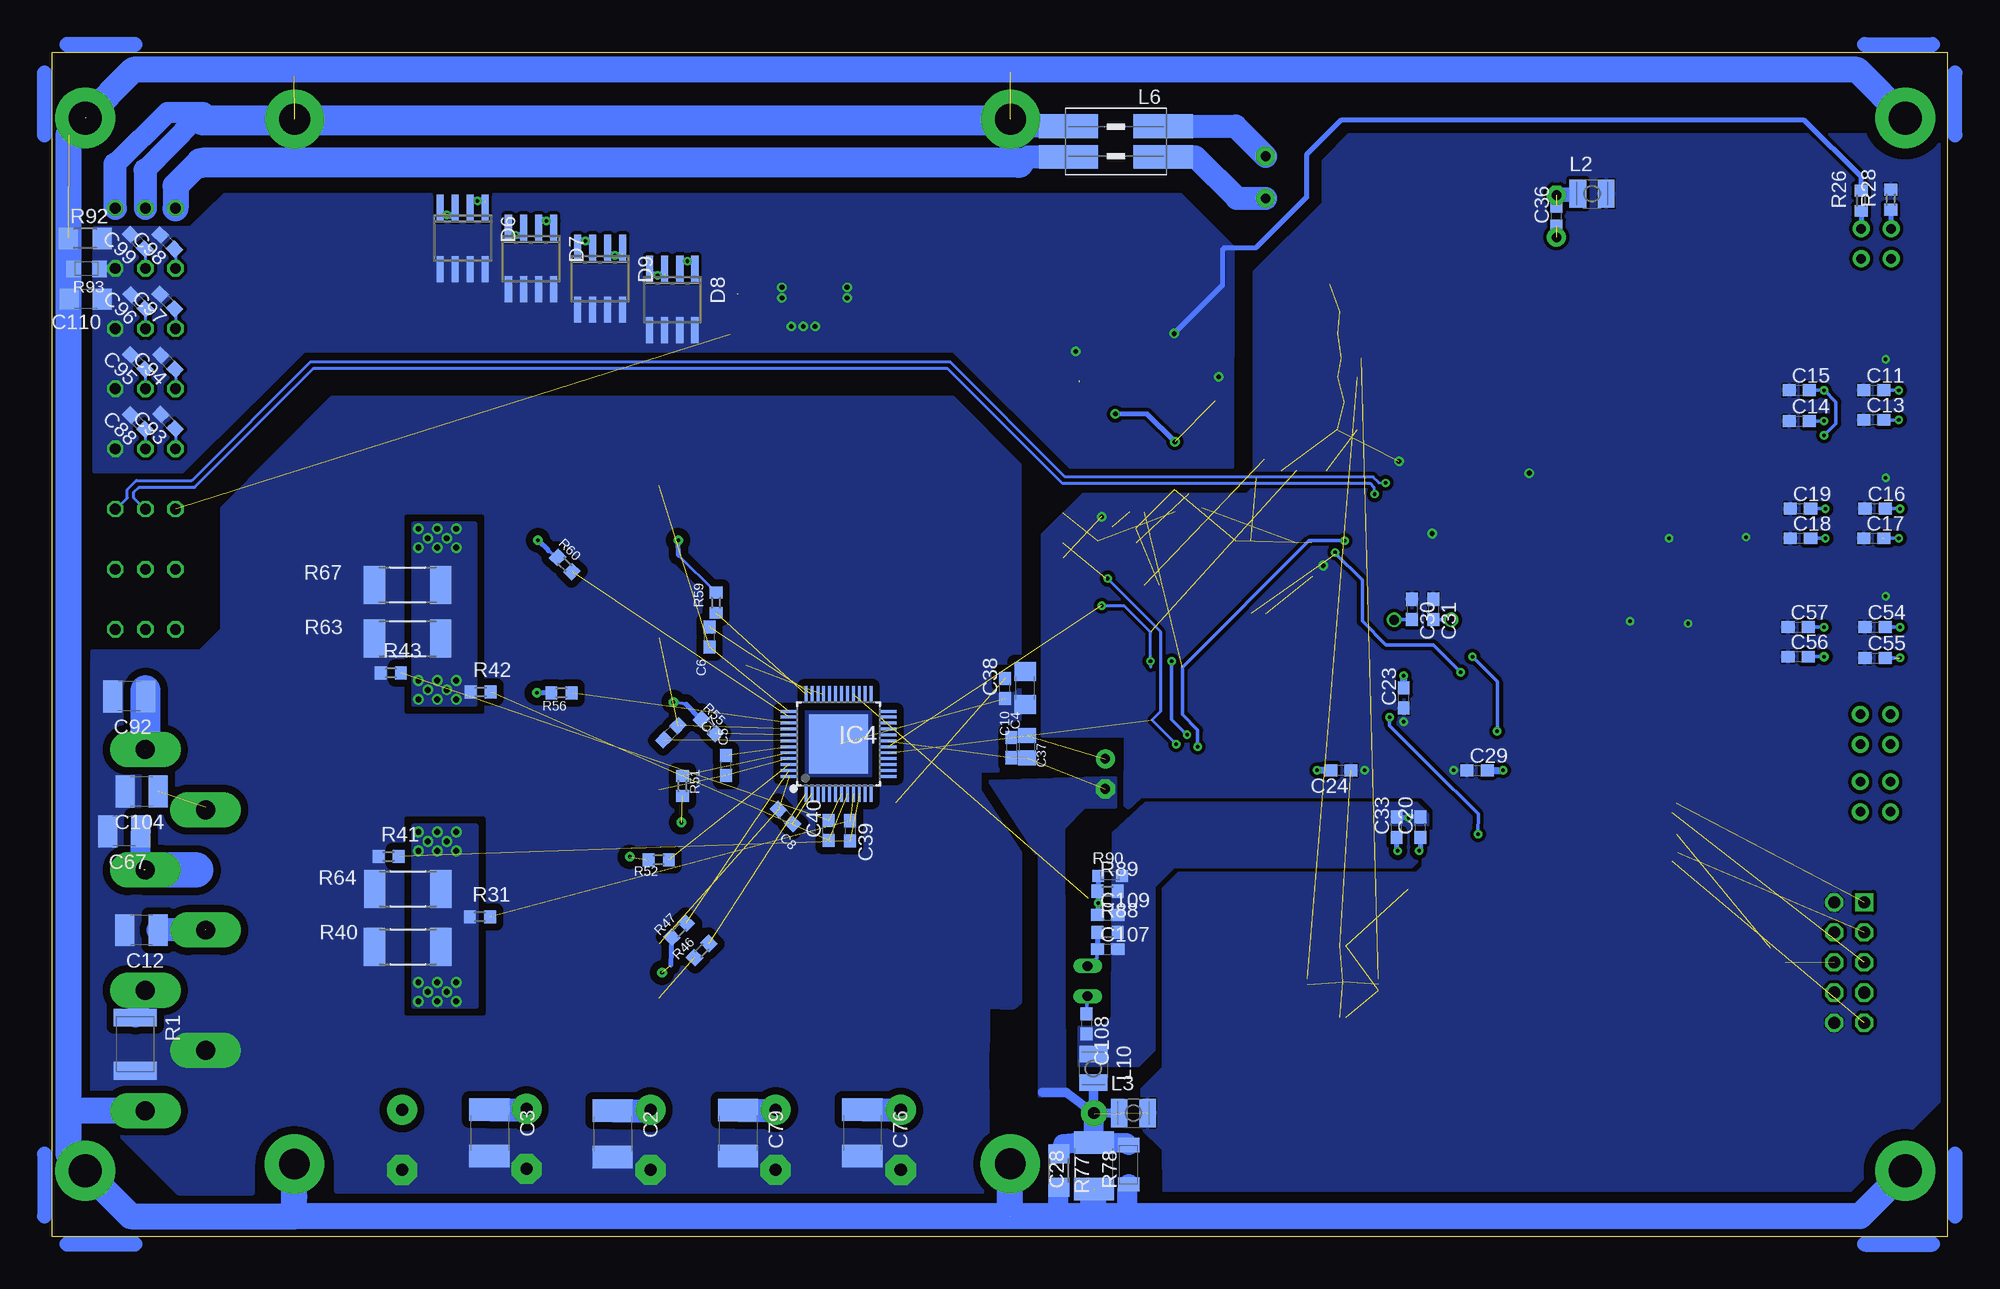
[diagram p6: board, bottom side, seen from below]

Size 160.02 x 100.03 mm. Coordinates in mm from the lower left corner, seen from the top.
Copper layers (1+16): Top 0.035mm / dielectric 1.5mm / Bottom 0.035mm
Design rules "default *": minimum track width 0.2mm, minimum drill 0.3mm, track to track 0.2mm, track to pad 0.2mm, pad to pad 0.2mm, via to via 0.2mm, smd to smd 0mil, copper to edge 10mil, drill to drill 8mil, minimum pad ring 8mil, minimum via ring 8mil, stop-mask expansion 4mil, vias tented up to drill 0mil, thermal gap 5mil

### Footprints (pad centres in the part's own frame; a part is rotated, then mirrored left to right if it is on the bottom)
E3,5-8 = drill 0.813 pad 1.6: + -1.778,0 | drill 0.813 pad 1.6 octagon: - 1.778,0
C1812 = smd 1.9 x 3.4: 1 -1.95,0; 2 1.95,0
C1206 = smd 1.6 x 1.8: 1 -1.4,0; 2 1.4,0
C0603 = smd 1.1 x 1: 1 -0.85,0; 2 0.85,0
C1210 = smd 1.6 x 2.7: 1 -1.4,0; 2 1.4,0
E5-10,5 = drill 1.016 pad 2.54: + -2.54,0 | drill 1.016 pad 2.54 octagon: - 2.54,0
E2,5-6 = drill 0.813 pad 1.6: + -1.27,0 | drill 0.813 pad 1.6 octagon: - 1.27,0
C0805 = smd 1.3 x 1.5: 1 -0.95,0; 2 0.95,0
SO08 = smd 0.6 x 2.2: 1 -1.905,-2.6; 2 -0.635,-2.6; 3 0.635,-2.6; 4 1.905,-2.6; 5 1.905,2.6; 6 0.635,2.6; 7 -0.635,2.6; 8 -1.905,2.6
SMB = smd 2.4 x 2.4: A 2.2,0; C -2.2,0
1801 = drill 0.8 pad 1.422: OA 0,0; OK 2.54,0; UA 0,2.54; UK 2.54,2.54
2,5-PAD = drill 2.6 pad 5: B2,5 0,0
TQFP44 = smd 1.5 x 0.5: 1 -5.8,4; 2 -5.8,3.2; 3 -5.8,2.4; 4 -5.8,1.6; 5 -5.8,0.8; 6 -5.8,0; 7 -5.8,-0.8; 8 -5.8,-1.6; 9 -5.8,-2.4; 10 -5.8,-3.2; 11 -5.8,-4; 23 5.8,-4; 24 5.8,-3.2; 25 5.8,-2.4; 26 5.8,-1.6; 27 5.8,-0.8; 28 5.8,0; 29 5.8,0.8; 30 5.8,1.6; 31 5.8,2.4; 32 5.8,3.2; 33 5.8,4 | smd 0.5 x 1.5: 12 -4,-5.8; 13 -3.2,-5.8; 14 -2.4,-5.8; 15 -1.6,-5.8; 16 -0.8,-5.8; 17 0,-5.8; 18 0.8,-5.8; 19 1.6,-5.8; 20 2.4,-5.8; 21 3.2,-5.8; 22 4,-5.8; 34 4,5.8; 35 3.2,5.8; 36 2.4,5.8; 37 1.6,5.8; 38 0.8,5.8; 39 0,5.8; 40 -0.8,5.8; 41 -1.6,5.8; 42 -2.4,5.8; 43 -3.2,5.8; 44 -4,5.8
SO223G = smd 1.2 x 1.4: 1 -2.311,-3.099; 2 0,-3.099; 3 2.311,-3.099 | smd 3.5 x 1.4: 4 0,3.099
MSSOP24 = smd 0.38 x 1.27: 1 -3.603,-3.766; 2 -2.947,-3.766; 3 -2.292,-3.766; 4 -1.637,-3.766; 5 -0.983,-3.766; 6 -0.328,-3.766; 7 0.328,-3.766; 8 0.983,-3.766; 9 1.637,-3.766; 10 2.292,-3.766; 11 2.947,-3.766; 12 3.603,-3.766; 13 3.603,3.766; 14 2.947,3.766; 15 2.292,3.766; 16 1.637,3.766; 17 0.983,3.766; 18 0.328,3.766; 19 -0.328,3.766; 20 -0.983,3.766; 21 -1.637,3.766; 22 -2.292,3.766; 23 -2.947,3.766; 24 -3.603,3.766
TQFP48-EP = smd 0.25 x 1.45: 1 -2.75,-4.175; 2 -2.25,-4.175; 3 -1.75,-4.175; 4 -1.25,-4.175; 5 -0.75,-4.175; 6 -0.25,-4.175; 7 0.25,-4.175; 8 0.75,-4.175; 9 1.25,-4.175; 10 1.75,-4.175; 11 2.25,-4.175; 12 2.75,-4.175; 25 2.75,4.175; 26 2.25,4.175; 27 1.75,4.175; 28 1.25,4.175; 29 0.75,4.175; 30 0.25,4.175; 31 -0.25,4.175; 32 -0.75,4.175; 33 -1.25,4.175; 34 -1.75,4.175; 35 -2.25,4.175; 36 -2.75,4.175 | smd 1.45 x 0.25: 13 4.175,-2.75; 14 4.175,-2.25; 15 4.175,-1.75; 16 4.175,-1.25; 17 4.175,-0.75; 18 4.175,-0.25; 19 4.175,0.25; 20 4.175,0.75; 21 4.175,1.25; 22 4.175,1.75; 23 4.175,2.25; 24 4.175,2.75; 37 -4.175,2.75; 38 -4.175,2.25; 39 -4.175,1.75; 40 -4.175,1.25; 41 -4.175,0.75; 42 -4.175,0.25; 43 -4.175,-0.25; 44 -4.175,-0.75; 45 -4.175,-1.25; 46 -4.175,-1.75; 47 -4.175,-2.25; 48 -4.175,-2.75 | smd 5 x 5: 49 0,0
TMC_QFN40_0.5_6.0X6.0 = smd 0.25 x 0.4: 1 -2.25,-3; 2 -1.75,-3; 3 -1.25,-3; 4 -0.75,-3; 5 -0.25,-3; 6 0.25,-3; 7 0.75,-3; 8 1.25,-3; 9 1.75,-3; 10 2.25,-3; 21 2.25,3; 22 1.75,3; 23 1.25,3; 24 0.75,3; 25 0.25,3; 26 -0.25,3; 27 -0.75,3; 28 -1.25,3; 29 -1.75,3; 30 -2.25,3 | smd 0.4 x 0.25: 11 3,-2.25; 12 3,-1.75; 13 3,-1.25; 14 3,-0.75; 15 3,-0.25; 16 3,0.25; 17 3,0.75; 18 3,1.25; 19 3,1.75; 20 3,2.25; 31 -3,2.25; 32 -3,1.75; 33 -3,1.25; 34 -3,0.75; 35 -3,0.25; 36 -3,-0.25; 37 -3,-0.75; 38 -3,-1.25; 39 -3,-1.75; 40 -3,-2.25 | smd 4.55 x 4.55: 41 0,0
SO08' = smd 0.66 x 2.032: 1 -1.905,-3.073; 2 -0.635,-3.073; 3 0.635,-3.073; 4 1.905,-3.073; 5 1.905,3.073; 6 0.635,3.073; 7 -0.635,3.073; 8 -1.905,3.073
UMAX8 = smd 0.45 x 1.2: 1 -0.975,-2.175; 2 -0.325,-2.175; 3 0.325,-2.175; 4 0.975,-2.175; 5 0.975,2.175; 6 0.325,2.175; 7 -0.325,2.175; 8 -0.975,2.175
SO-16 = smd 0.61 x 1.524: 1 -4.445,-2.794; 2 -3.175,-2.794; 3 -1.905,-2.794; 4 -0.635,-2.794; 5 0.635,-2.794; 6 1.905,-2.794; 7 3.175,-2.794; 8 4.445,-2.794; 9 4.445,2.667; 10 3.175,2.667; 11 1.905,2.667; 12 0.635,2.667; 13 -0.635,2.667; 14 -1.905,2.667; 15 -3.175,2.667; 16 -4.445,2.667
H7/24L_EK_FP = drill 0.914 octagon: B2 152.146,36.83; B4 152.146,31.75; B6 152.146,26.67; B8 152.146,21.59; B10 152.146,16.51; B12 152.146,11.43; B14 152.146,6.35; B16 152.146,1.27; D2 149.606,36.83; D4 149.606,31.75; D6 149.606,26.67; D8 149.606,21.59; D10 149.606,16.51; D12 149.606,11.43; D14 149.606,6.35; D16 149.606,1.27; Z2 154.686,36.83; Z4 154.686,31.75; Z6 154.686,26.67; Z8 154.686,21.59; Z10 154.686,16.51; Z12 154.686,11.43; Z14 154.686,6.35; Z16 154.686,1.27 | drill 1.6 pad 3 long: D22 147.066,-13.97; D26 147.066,-24.13; D30 147.066,-34.29; Z20 152.146,-8.89; Z24 152.146,-19.05; Z28 152.146,-29.21; Z32 152.146,-39.37 | drill 2.794 pad 5.08: S1 3.556,44.45; S2 157.226,44.45; S3 157.226,-44.45; S4 3.556,-44.45
AVR-JTAG-10R = drill 1.016 square: 1 -5.08,-1.27 | drill 1.016 octagon: 2 -5.08,1.27; 3 -2.54,-1.27; 4 -2.54,1.27; 5 0,-1.27; 6 0,1.27; 7 2.54,-1.27; 8 2.54,1.27; 10 5.08,1.27 | drill 1.016 pad 1.422 octagon: 9 5.08,-1.27
0805 = smd 1.2 x 1: 1 -1.1,0; 2 1.1,0
L2825P = smd 1.4 x 2.4: 1 -1.2,0; 2 1.2,0
WE-CMS_7427521 = smd 5 x 2: 1 -4,1.3; 2 -4,-1.3; 3 4,-1.3; 4 4,1.3
B82472 = smd 1.5 x 2.2: 1 -3.2,0; 2 3.2,0
SOIC08 = smd 0.66 x 2.032: 1 -1.905,-3.073; 2 -0.635,-3.073; 3 0.635,-3.073; 4 1.905,-3.073; 5 1.905,3.073; 6 0.635,3.073; 7 -0.635,3.073; 8 -1.905,3.073
D-PAK_TO252AA = smd 1 x 1.6: 1 -2.28,-4.8; 3 2.28,-4.8 | smd 5.4 x 6.2: 4 0,2.5
HC49/S = drill 0.813: 1 -2.413,0; 2 2.413,0
CT/CN1812 = smd 1.5 x 3.6: 1 -2.25,0; 2 2.25,0
R0603 = smd 1 x 1.1: 1 -0.85,0; 2 0.85,0
R2512 = smd 1.8 x 3.2: 1 -2.8,0; 2 2.8,0
R1206 = smd 1.6 x 1.803: 1 -1.422,0; 2 1.422,0
CT/CN1206 = smd 1.2 x 1.8: 1 -1.65,0; 2 1.65,0
CT/CN0805 = smd 1.2 x 1.4: 1 -1.1,0; 2 1.1,0
P642 = drill 0.813 long: 1 -1.27,0; 2 1.27,0
CT/CN0603 = smd 1 x 1: 1 -1,0; 2 1,0
REF-DRUCK = smd 0.152 x 0.152: P$1 0,0
COPAL_HEX = smd 1.27 x 2.54: 1 0,-3.175; 2 2.54,-3.175; 4 2.54,3.175; 8 0,3.175; C1 -2.54,-3.175; C2 -2.54,3.175

### Placement (x,y rotation side)
C1  57.57,89.46 90 top
C2  112.7,8.67 270 bottom
C3  123.1,8.77 270 bottom
C4  77.86,46.33 90 bottom
C5  103.12,39.8 90 bottom
C6  104.52,50.63 90 bottom
C7  107.78,42.55 225 bottom
C8  98.1,35.47 315 bottom
C9  87.94,36.61 0 top
C10  79.04,41.29 270 bottom
C11  6.2,71.47 0 bottom
C12  152.48,25.88 180 bottom
C13  6.2,68.97 0 bottom
C14  12.5,68.87 0 bottom
C15  12.5,71.47 0 bottom
C16  6.1,61.47 0 bottom
C17  6.2,58.97 0 bottom
C18  12.4,58.97 0 bottom
C19  12.4,61.47 0 bottom
C20  44.5,34.57 90 bottom
C21  50.66,76.25 0 top
C22  25.7,51.07 90 top
C23  45.9,45.47 90 bottom
C24  51.2,39.37 180 bottom
C25  88.37,8.17 270 top
C26  130.49,8.17 270 top
C27  71.1,39.07 270 top
C28  72.06,5.98 90 bottom
C29  39.7,39.37 0 bottom
C30  45.2,52.97 270 bottom
C31  43.4,52.97 270 bottom
C32  44.3,65.47 0 top
C33  46.5,34.57 90 bottom
C34  33,86.17 90 top
C35  51.8,86.37 90 top
C36  33,86.17 90 bottom
C37  77.72,41.37 270 bottom
C38  79.58,46.29 90 bottom
C39  92.64,34.27 270 bottom
C40  94.48,34.31 90 bottom
C41  50.5,78.09 0 top
C42  51.32,80.45 0 top
C43  50.34,74.19 0 top
C44  50.66,72.57 0 top
C45  50.08,70.49 0 top
C46  50.68,68.13 0 top
C48  71.13,59.34 135 top
C51  54.15,56.41 225 top
C54  6.1,51.47 0 bottom
C55  6.1,48.87 0 bottom
C56  12.6,48.97 0 bottom
C57  12.6,51.47 0 bottom
C66  61.26,71.15 135 top
C67  153.94,34.22 180 bottom
C76  91.61,8.76 270 bottom
C77  119.96,8.26 270 top
C78  109.5,8.18 270 top
C79  102.11,8.74 270 bottom
C80  98.93,8.18 270 top
C81  90.72,77.82 90 top
C86  100.13,74.61 90 top
C87  101.27,79.6 180 top
C88  152.79,68.78 135 bottom
C92  153.52,45.63 180 bottom
C93  150.24,68.83 135 bottom
C94  150.24,73.84 135 bottom
C95  152.79,73.85 135 bottom
C96  152.76,78.94 135 bottom
C97  150.29,78.96 135 bottom
C98  150.29,83.99 135 bottom
C99  152.81,84.02 135 bottom
C104  152.47,37.58 180 bottom
C105  136.24,54.33 45 top
C106  135.64,29.08 90 top
C107  70.9,24.27 0 bottom
C108  72.7,17.97 270 bottom
C109  70.9,27.17 0 bottom
C110  157.18,79.17 180 bottom
D6  125.36,84.3 180 bottom
D7  119.59,82.6 180 bottom
D8  107.66,79.14 180 bottom
D9  113.76,80.9 180 bottom
D10  41.1,86.77 90 top
DZ1  7.28,82.57 90 top
DZ3  7.34,41.57 90 top
DZ4  7.34,35.87 90 top
H1  79.12,6.15 0 top
H2  79.1,94.37 0 top
H3  139.55,94.37 0 top
H4  139.57,6.13 0 top
IC1  45.5,39.77 270 top
IC2  95.6,76.87 0 top
IC3  20.6,53.97 180 top
IC4  93.62,41.61 0 bottom
IC5  51.02,21.53 0 top
IC7  MAX3072EESA  [SO08']  40.4,62.27 270 top
IC8  47.7,85.77 270 top
IC15  67.77,72.92 45 top
J2  0,50.01 0 top
JP1  8.29,23.15 270 top
L1  45.5,30.47 90 top
L2  30,88.07 0 bottom
L3  68.72,10.45 0 bottom
L5  102.76,74.98 270 top
L6  70.2,92.47 180 bottom
L7  41.2,80.07 180 top
L10  72.1,14.2 270 bottom
L11  69.4,20.27 0 top
OK1  54.34,61.63 0 top
OK2  71.58,59.21 270 top
OK3  59.44,55.67 180 top
OK4  67.14,58.11 0 top
Q1  122.5,63.58 0 top
Q2  44.3,52.07 0 top
Q3  122.43,37.97 0 top
Q4  103.96,61.16 90 top
Q5  103.96,22.46 90 top
Q6  122.5,50.72 0 top
Q7  122.43,25.17 0 top
Q8  103.96,35.46 90 top
Q10  103.94,48.26 90 top
R1  153.01,16.25 270 bottom
R5  37.3,44.97 90 top
R6  14.28,23.72 225 top
R7  48.3,48.57 45 top
R8  37.3,66.27 90 top
R9  35.3,62.47 270 top
R10  45.6,62.27 90 top
R11  38.1,85.97 270 top
R12  43.9,87.67 270 top
R13  22.9,45.27 225 top
R15  10.94,44.07 0 top
R16  10.94,42.07 0 top
R17  10.94,38.47 0 top
R18  10.94,36.47 0 top
R24  57.04,42.19 0 top
R25  57.1,40.37 0 top
R26  7.28,87.47 90 bottom
R27  21.7,46.43 225 top
R28  4.78,87.57 90 bottom
R29  60.6,36.47 0 top
R31  123.9,27.01 0 bottom
R32  69.94,53.55 225 top
R33  62.32,62.11 135 top
R34  72.34,55.47 45 top
R35  63.5,63.3 135 top
R36  50.57,56.48 225 top
R37  59.38,65.15 45 top
R38  49.45,57.58 225 top
R39  58.25,66.28 45 top
R40  130,24.48 0 bottom
R41  131.6,32.09 0 bottom
R42  123.84,45.99 0 bottom
R43  131.42,47.61 0 bottom
R46  105.17,24.16 45 bottom
R47  107.1,25.88 45 bottom
R51  106.79,38.06 90 bottom
R52  108.81,31.83 0 bottom
R55  104.62,43.08 315 bottom
R56  117.02,45.93 0 bottom
R59  103.97,53.53 270 bottom
R60  116.74,56.76 315 bottom
R63  130.01,50.5 0 bottom
R64  130,29.38 0 bottom
R67  130.01,55.04 0 bottom
R77  75.01,5.58 270 bottom
R78  69.13,6.08 90 bottom
R79  68.2,67.1 225 top
R80  72.67,71.58 45 top
R81  62.92,74.22 225 top
R82  67.39,78.69 45 top
R83  101.12,77.94 180 top
R85  135.97,58.62 45 top
R86  134.7,33.71 45 top
R87  72.6,21.57 270 top
R88  70.9,25.67 0 bottom
R89  70.9,29.17 0 bottom
R90  70.7,30.47 0 bottom
R91  73.5,27.17 180 top
R92  157.23,84.3 0 bottom
R93  157.13,81.74 180 bottom
REF1  9.53,95.23 0 top
REF2  157.79,25.97 0 top
S1  5.2,61.47 270 top
S2  5.2,71.47 270 top
S3  5.2,51.47 270 top

### Tracks (layer width: path | path; a pad name or v marks a point on that pad's centre or on a via)
0V
  Bottom 0.406: 147.31,94.29 147.98,94.81 147.98,94.31
  Bottom 1.778: 147.98,94.31 152.17,90.07 | 147.31,94.29 147.3,94.87 147.25,94.92 150.29,94.92 154.71,90.58 | 78.4,94.27 77.9,93.77 77.72,93.77
  Bottom 1.93: 152.17,90.07 152.15,90.04 J2.B2 | J2.Z2 154.71,86.87 154.71,90.58 | L6.3 77.72,93.77
  Bottom 2.54: 147.31,94.29 147.3,94.27 78.4,94.27
1A  (3 unrouted)
  Bottom 1.93: 147.09,25.88 C12.1
  Bottom 2.54: J2.D26
  pour Top (isolate 0.508, rank 3, no thermals): 131.98,31.06 134.19,28.85 138.26,28.85 139.07,28.04 149.44,28.04 150.07,27.41 150.07,24.99 149.59,24.51 134,24.51 132.5,23.03 123.3,23.03 123.3,19.27 107.21,19.33 107.21,31.06
1B  (3 unrouted)
  Bottom 1.676: 152.3,30.99 152.48,30.99 152.54,30.99 C67.1
  Bottom 3: J2.Z24 147.89,30.96
  pour Top (isolate 0.508, rank 3, no thermals): 131.9,43.87 142.7,33.07 154.31,33.07 155.15,32.23 155.15,30.07 154.64,29.57 139.71,29.57 133.72,35.46 123.43,35.46 123.4,32.13 107.21,32.13 107.21,43.87
2A  (3 unrouted)
  Bottom 1.93: J2.D22 147.09,36.02
  Bottom 2.54: J2.D22 147.07,36.24
  pour Top (isolate 0.508, rank 3, no thermals): 133.12,56.59 138.68,51.03 138.68,46.43 146.97,38.17 149.34,38.17 150.05,37.44 150.05,35.13 149.57,34.65 143.64,34.65 133.69,44.6 131.31,47.09 130.04,48.36 123.53,48.36 123.48,44.83 107.21,44.83 107.21,56.59
2B  (3 unrouted)
  Bottom 1.93: 152.17,41.12 C92.1
  Bottom 2.54: 152.17,41.12 152.13,41.42 152.14,41.43 152.14,46.15
  pour Top (isolate 0.508, rank 3, no thermals): 135.84,70.77 145.69,60.92 145.63,48.78 150.95,43.46 154.29,43.46 155.1,42.65 155.1,40.23 154.57,39.73 147.96,39.73 140.39,47.29 140.39,55.29 134.34,61.34 123.25,61.34 123.28,57.73 107.21,57.73 107.21,70.77
485_N  (via drill 0.3)
  Top 0.254: v47.43,63.64 47.4,63.07 46.88,62.55 46.17,62.55 R10.2 45.03,62.55 44.5,62.55 44.14,62.91 IC7.7
  Bottom 0.254: v47.43,63.64 48,63.67 48.48,64.15 74.48,64.15 84.18,73.85 138.22,73.85 148.22,63.85 152.92,63.85 153.68,63.09 153.68,62.37 154.61,61.44 J2.Z12
485_P  (via drill 0.3)
  Top 0.254: v48.37,62.71 47.8,62.68 47.12,62 46.17,62 R10.1 45.03,62 44.5,62 44.14,61.64 IC7.6
  Bottom 0.254: v48.37,62.71 48.4,63.28 48.72,63.6 74.72,63.6 84.42,73.3 137.98,73.3 147.98,63.3 152.68,63.3 153.12,62.86 153.12,62.37 152.19,61.44 J2.B12
!I2C_INT
  Top 0.305: IC1.12 37.55,43.77 R5.1 36.65,43.82 31.3,49.17 31.3,52.67 26.2,57.77 24.24,57.77 IC3.1
+3V3  (via drill 0.3)  (9 unrouted)
  Bottom 0.61: C23.2 v45.9,47.37 | C24.2 v53.2,39.37 | C29.2 v37.5,39.37
  pour Top (isolate 0.305, rank 3): 8.96,3.9 8.17,3.9 0.7,11.37 0.72,93.05 57.7,93.07 57.76,93.07 59.48,91.35 59.48,75.96 52,68.47 52,63.37 59.3,56.07 65.4,56.07 69.4,60.07 74.3,60.07 76.4,57.97 76.4,36.77 69.3,29.67 69.28,29.36 69.24,24.41 69.22,3.9
+24V
  Bottom 1.93: L6.4 77.6,91.17 78.4,90.67
  Bottom 2.184: 147.37,90.68 147.57,90.78 149.61,88.75 J2.D2
  Bottom 2.54: 78.4,90.67 147.37,90.68
A4989_EN  (1 unrouted)
  Top 0.254: R29.2 62.6,36.47 70.1,28.97 72.1,28.97 72.5,28.57
AGND  (via drill 0.3)
  Top 0.406: IC1.28 v45.5,35.37
  Bottom 0.406: C20.2 45.45,35.42 v45.5,35.37 46.45,35.37 C33.2
  pour Bottom (isolate 0.406, no thermals): 73.3,14.47 68.3,14.47 67,15.77 67,29.57 65.3,31.27 45.2,31.27 43.9,32.57 43.9,35.67 44.8,36.57 67.7,36.57 70.4,34.07 70.5,18.47 71.3,17.67 73.3,17.67
DGND  (via drill 0.3, 0.4, 0.4 pad 0.81)  (20 unrouted)
  Top 0.305: 2.02,74.07 S2.C1 | 8.38,74.07 S2.C2 | 2.02,64.07 S1.C1 | 8.38,64.07 S1.C2 | 2.02,54.07 S3.C1 | 8.38,54.07 S3.C2
  Top 0.406: IC1.6 45.5,43.87 v45.9,43.47 | IC1.39 49.6,39.77 v49.2,39.37 | IC1.18 41.3,38.97 v41.7,39.37 | v26.8,51.97 C22.2 | IC3.21 22.24,51.44 v21.9,51.77 | IC3.12 v17,59.07 | v23.5,58.97 23.55,59.13 IC3.2 IC3.3 | v35.3,64.47 R9.1 | C32.2 v46.3,65.47 | v43.5,59.37 43.5,60.34 IC7.5 | v52.7,56.67 52.7,56.65 C51.2 | C48.2 70.55,59.94 v71.41,60.79
  Top 0.61: 2.02,74.07 v5.2,74.07 8.38,74.07 | 2.02,64.07 v5.2,64.07 8.38,64.07 | 2.02,54.07 v5.2,54.07 8.38,54.07
  Bottom 0.812: 72,10.37 74.4,12.17 76.4,12.17
  pour Bottom (isolate 0.305, rank 3): 0.72,11.39 8.18,3.89 8.2,3.87 66.15,3.92 66.17,7.38 68.02,9.16 68.02,12.45 66.19,14.27 66.2,28.77 66.19,33.81 69.44,36.41 69.4,42.27 76.4,42.27 76.4,59.27 73,62.67 59.1,62.67 58.5,63.37 58.5,81.47 52.7,87.27 52.7,90.87 50.52,93.05 50.52,93.05 0.72,93.05
  pour Bottom (isolate 0.305, no thermals): 80.88,38.43 76.9,32.37 76.7,32.17 76.7,11.87 74.5,11.87 74.6,34.47 72.8,36.27 70.2,36.27 70.2,38.77
DIR  (via drill 0.3)
  Top 0.305: v40.1,48.97 37.8,51.27 37.8,57.57 35.6,59.77 35.35,60.07 R9.2 35.41,61.54 IC7.3 IC7.2 | v38,42.67 38.3,42.97 IC1.13
  Bottom 0.305: v40.1,48.97 38,46.87 v38,42.67
DIR/ENC_B_N  (via drill 0.3)  (1 unrouted)
  Top 0.254: IC15.7 73,72.18 R80.2 73.3,71.37 73.42,71.25 76.18,71.25 88.68,83.75 111.68,83.75 112,84.07 v115,84.07 115.6,84.07 115.92,83.75 128.72,83.75 135.52,76.95 147.42,76.95 151.18,73.19 151.18,72.57 J2.B8 | 73.18,72.29 73.3,72.27
  Bottom 0.254: C95.1 152.15,73.11 J2.B8 | D9.4 115.5,83.67 115.5,84.07 | D9.3 114.4,84.07 114.5,84.07
  Bottom 0.61: 114.5,84.07 v115,84.07 115.5,84.07 115.6,84.07
DIR/ENC_B_P  (via drill 0.3)  (1 unrouted)
  Top 0.254: IC15.6 72.07,71.31 R80.1 72.11,70.93 72.95,70.93 73.18,70.7 76.42,70.7 88.92,83.2 111.68,83.2 112,82.87 v112.5,82.87 115.6,82.87 115.92,83.2 128.38,83.2 135.18,76.4 147.18,76.4 150.62,72.96 150.62,72.57 149.66,71.6 J2.D8
  Bottom 0.254: D9.2 113.13,82.9 113.1,82.87 | C94.1 149.61,73.1 J2.D8 | D9.1 111.85,83.02
  Bottom 0.61: 113.1,82.87 v112.5,82.87 111.9,82.87
ENA/ENC_S_N  (via drill 0.3)  (1 unrouted)
  Top 0.254: IC15.9 67.99,78.98 R82.2 67.98,79.3 67.17,79.3 66.78,79.69 66.78,80.36 67.32,80.9 69.98,80.9 72.68,78.2 81.72,78.2 88.42,84.9 117.48,84.9 117.8,84.57 v120.9,84.57 121.4,84.57 121.72,84.9 129.18,84.9 136.18,77.9 145.92,77.9 147.02,79 149.98,79 150.62,78.36 150.62,77.65 149.66,76.68 J2.D6
  Bottom 0.254: C97.1 149.61,78.17 J2.D6 | D7.3 120.2,85.17 120.2,84.57 | D7.4 121.45,85.15 121.45,84.62
  Bottom 0.61: 120.2,84.57 v120.9,84.57 121.5,84.57
ENA/ENC_S_P  (via drill 0.3)
  Top 0.254: R82.1 67.09,78.09 IC15.10 66.83,78.35 66.83,78.85 66.8,78.87 66.22,79.46 66.22,80.59 67.08,81.45 70.22,81.45 72.92,78.75 81.48,78.75 88.18,85.45 117.48,85.45 117.8,85.77 v118.3,85.77 121.4,85.77 121.72,85.45 129.52,85.45 136.52,78.45 145.68,78.45 146.78,79.55 150.22,79.55 151.18,78.59 151.18,77.65 J2.B6
  Bottom 0.254: 118.9,85.77 118.9,85.26 D7.2 | D7.1 117.69,85.66 117.8,85.77 v118.3,85.77 | C96.1 152.15,78.23 J2.B6
  Bottom 0.61: 117.7,85.77 v118.3,85.77 118.9,85.77
ENCODER_A0  (via drill 0.3)
  Top 0.305: IC3.4 22.24,60.94 10.4,72.77 6.6,72.77 5.3,71.47 v4.1,71.47 S2.1
  Bottom 0.305: C11.2 v4.1,71.47
ENCODER_A1  (via drill 0.3)
  Top 0.305: IC3.5 21.58,60.39 11.8,70.17 6.9,70.17 5.7,68.97 v4.1,68.97 2.06,68.97 S2.2
  Bottom 0.305: C13.2 v4.1,68.97
ENCODER_A2  (via drill 0.3)
  Top 0.305: IC3.6 20.93,59.85 11.9,68.87 v10.4,68.87 8.44,68.87 S2.4
  Bottom 0.305: C14.2 v10.4,68.87
ENCODER_A3  (via drill 0.3)
  Top 0.305: IC3.7 20.27,59.3 11.9,67.67 v10.4,67.67 | S2.8 v10.4,71.47
  Bottom 0.305: C15.2 v10.4,71.47 9.4,70.47 9.4,68.67 v10.4,67.67
ENCODER_B0  (via drill 0.3)
  Top 0.305: IC3.8 19.62,58.76 15.7,62.67 7,62.67 5.8,61.47 v4,61.47 S1.1
  Bottom 0.305: C16.2 v4,61.47
ENCODER_B1  (via drill 0.3)  (1 unrouted)
  Top 0.305: IC3.9 18.96,56.14 17.8,54.97 14.8,54.97 12.2,57.57 6.9,57.57 5.5,58.97 2.06,58.97 S1.2
  Bottom 0.305: C17.2 v4.1,58.97
ENCODER_B2  (via drill 0.3)
  Top 0.305: IC3.10 18.31,56.38 17.5,55.57 15.2,55.57 11.8,58.97 v10.3,58.97 8.41,58.97 S1.4
  Bottom 0.305: C18.2 v10.3,58.97
ENCODER_B3  (via drill 0.3)
  Top 0.305: IC3.11 17.65,56.63 17.2,56.17 15.6,56.17 v10.3,61.47 S1.8
  Bottom 0.305: C19.2 v10.3,61.47
ENCODER_C0  (via drill 0.3)
  Top 0.254: 6.6,47.67 5.5,48.77
  Top 0.305: IC3.13 17,49.27 15.4,47.67 6.6,47.67 | 5.5,48.77 5.5,50.97 5,51.47 v4,51.47 S3.1
  Bottom 0.305: C54.2 v4,51.47
ENCODER_C1  (via drill 0.3)  (1 unrouted)
  Top 0.305: IC3.14 17.65,49.03 15.7,47.07 6.25,47.07 4.45,48.87 2.08,48.87 S3.2
  Bottom 0.305: C55.2 v4,48.87
ENCODER_C2  (via drill 0.3 pad 0.81)
  Top 0.305: IC3.15 18.31,51.17 17.6,51.87 16.2,51.87 13.3,48.97 v10.4,48.97 10.4,48.93 S3.4
  Bottom 0.305: v10.4,48.97 C56.2
ENCODER_C3  (via drill 0.3)
  Top 0.305: IC3.16 18.96,51.41 17.9,52.47 15.8,52.47 14.8,51.47 v10.4,51.47 S3.8
  Bottom 0.305: v10.4,51.47 C57.2
HA1  (1 unrouted)
HA2  (1 unrouted)
HB1  (1 unrouted)
HB2  (1 unrouted)
I2C_SCL
  Top 0.254: 22.89,47.63 R27.1
  Top 0.305: 22.89,47.63 IC3.22 22.89,52.17 24.5,53.77 27.2,53.77 29.2,51.77 29.2,44.17 35.2,38.17 IC1.19
I2C_SDA
  Top 0.305: IC1.20 34.8,37.37 28.45,43.72 28.4,43.77 28.4,51.57 26.9,53.07 24.8,53.07 23.55,51.82 IC3.23 23.55,46.42 R13.1
IF_GND  (via drill 0.4, 0.4 pad 0.81)
  Top 0.305: C66.2 60.77,71.85 | IC15.12 66.3,75.26 | IC15.8 72.92,74.09
  Top 0.406: 60.77,71.85 v61.52,72.6 | 66.3,75.26 v65.29,76.26 | 72.92,74.09 v73.59,74.76
  Bottom 0.406: R26.2 7.28,89.49 12.06,94.27 51.2,94.27 54.1,91.37 54.1,87.77 58.4,83.47 61.1,83.47 61.2,83.37 61.2,80.35 v65.29,76.26
  other vias: 92.9,80.17 98.4,80.17 98.4,79.27 92.9,79.27 95.6,76.87 96.6,76.87 97.6,76.87
  pour Bottom (isolate 0.305, no thermals): 60.32,83.58 60.32,83.6 64.7,87.97 145.5,87.98 148.34,85.24 156.49,85.22 156.49,64.62 149,64.62 147.73,65.89 141.53,71.98 138.72,74.79 83.91,74.79 74.1,64.97 60.38,64.99
  pour Top (isolate 0.305, no thermals): 87.7,78.17 92.6,78.17 94.5,76.27 94.5,73.07 96.6,73.07 96.6,74.67 96.9,74.97 100.7,74.97 100.9,75.17 100.9,80.27 100.5,80.67 90.2,80.67
IF_PWR  (2 unrouted)
  Top 1.27: 102.2,79.57 102.22,79.56 R83.1 102.22,76.72 L5.1
IN_DIR/ENC_B
  Top 0.254: IC15.5 69.37,72.22 67.71,72.22 63.73,68.23 61.71,66.22 R33.2
IN_ENA/ENC_S
  Top 0.254: IC15.11 68.04,75.35 68.04,73.73 60.06,65.75 R37.2
IN_STEP/ENC_A
  Top 0.254: IC15.3 67.71,70.28 66.64,70.28 62.9,66.54 R35.2
IN_SYNC/ENC_I
  Top 0.254: IC15.13 66.15,73.64 66.15,72.71 61.02,67.57 59.5,67.57 58.85,66.92 R39.2
LA1  (1 unrouted)
LA2  (1 unrouted)
LB1  (1 unrouted)
LB2  (1 unrouted)
N$2  (1 unrouted)
N$4  (2 unrouted)
N$5  (2 unrouted)
N$6
  Top 1.27: IC2.3 97.93,73.76 C86.1 100.15,73.78 L5.2
N$7  (1 unrouted)
N$8  (1 unrouted)
N$9  (1 unrouted)
N$10  (2 unrouted)
N$11  (2 unrouted)
N$12  (1 unrouted)
N$13  (1 unrouted)
N$14  (via drill 0.3)  (1 unrouted)
  Top 0.254: IC1.4 47.1,47.37 R7.1
  Top 0.305: v47.1,43.87 IC1.4 | 22.84,33.97 v39.62,33.97
  Bottom 0.305: v47.1,43.87 47.1,43.17 43.6,39.67 39.6,35.67 v39.62,33.97
N$15
  Top 0.305: R87.1 72.53,24.44 62.3,34.67 53.9,34.67 52.7,35.77 IC1.34
  Bottom 0.305: R87.1 71.8,23.52 C107.1
  Bottom 0.406: R88.1 C107.1
N$16  (1 unrouted)
  Top 0.305: IC1.21 22.9,36.57
N$17  (1 unrouted)
  Top 0.305: IC1.22 23.2,35.77
N$18  (1 unrouted)
  Top 0.305: IC1.23 41.5,33.05 40.86,32.41 22.74,32.41
N$19  (1 unrouted)
  Top 0.305: IC1.24 42.3,32.77 41.2,31.67 23.2,31.67
N$20  (via drill 0.3)
  Top 0.406: IC1.27 44.7,32.67 v44.6,32.57 45.5,31.67 | IC1.29 46.3,32.67 v46.4,32.57 45.5,31.67 | L1.2 45.5,31.67
  Bottom 0.406: C20.1 44.5,32.67 v44.6,32.57 | C33.1 46.5,32.67 v46.4,32.57
N$21  (1 unrouted)
N$22  (1 unrouted)
N$23
  Top 0.305: IC1.7 44.7,50.06 Q2.2
  Bottom 0.305: C30.2 46.66,52.12 Q2.2
N$24
  Top 0.305: IC1.8 43.9,50.06 Q2.1
  Bottom 0.305: C31.2 41.94,52.12 Q2.1
N$25  (1 unrouted)
N$26
  Top 0.254: DZ3.OK 7.38,44.07
  Top 0.305: 7.38,44.07 R15.1
N$27
  Top 0.305: DZ3.UK 6.04,42.87 8.24,42.87 9.04,42.07 R16.1
N$28
  Top 0.254: 10.03,38.41 R17.1
  Top 0.305: DZ4.OK 10.03,38.41
N$29
  Top 0.305: DZ4.UK 6.04,37.17 8.44,37.17 9.14,36.47 R18.1
N$30
  Top 0.305: IC3.17 19.62,48.99 14.7,44.07 R15.2
N$31
  Top 0.305: IC3.18 20.27,48.65 16.9,45.27 16.9,43.37 15.6,42.07 R16.2
N$32
  Top 0.305: IC3.19 20.93,48.3 17.6,44.97 17.6,41.17 14.9,38.47 R17.2
N$33
  Top 0.305: IC3.20 21.58,47.96 18.2,44.57 18.2,39.57 15.1,36.47 R18.2
N$34  (1 unrouted)
N$35  (1 unrouted)
  Top 0.254: 58.04,64.08 58.33,64.08 58.78,64.53 R37.1
N$37  (1 unrouted)
N$38  (via drill 0.3 pad 0.81)  (1 unrouted)
  Top 0.305: Q7.1 119.45,19.27 110.9,19.27 110.3,19.87 110.3,21.27 109.9,21.67 109.08,21.7 v108.52,22.3
  Bottom 0.406: R47.1 107.8,22.92
N$40
  pour Top (isolate 0.406, no thermals): 46,84.87 46,78.37 42.5,78.37 42.5,82.67 40,82.67 40,85.67 44.4,85.67 44.4,84.87
N$41
  Top 0.305: R11.1 R12.2 43.9,86.75 IC8.1
N$47  (via drill 0.3 pad 0.81)  (1 unrouted)
  Top 0.305: Q3.1 119.37,31.87 115.3,31.87 113.57,31.87 v111.25,32.08
N$48  (via drill 0.3 pad 0.81)  (1 unrouted)
  Top 0.305: v106.89,34.98 107.84,34.11 108.28,33.61 108.74,33.2
  Top 0.61: 108.74,33.2 Q8.1
N$52
  Top 0.254: IC1.42 54.72,42.17 R24.1
N$56
  Top 0.254: IC1.40 56.05,40.57 R25.1
N$57
  Bottom 0.406: R26.1 DZ1.OK
N$60
  Bottom 0.406: R28.1 4.78,85.15 DZ1.UK
N$61
  Top 0.254: IC1.36 54.2,37.37 55.1,36.47 R29.1
N$63
  Bottom 1.93: L6.1 63.5,91.17 60,87.67 C1.+
  pour Top (isolate 0.406, no thermals): 59.5,88.87 59.5,84.27 49.4,84.27 49.4,86.07 53.6,86.07 53.6,88.87
N$64  (1 unrouted)
  Bottom 1.27: L2.1 31.5,87.97 C34.-
  Bottom 1.93: L6.2 60.11,93.77 C1.-
  pour Top (isolate 0.406, no thermals): 57.8,93.07 31.7,92.97 31.7,86.97 37.2,86.97 37.2,87.67 46.5,87.67 46.5,86.17 45,86.17 45,85.37 46.6,85.37 46.6,84.27 48.8,84.27 48.8,86.77 52.9,86.77 52.9,89.57 59.5,89.57 59.5,91.37
N$69  (via drill 0.3 pad 0.81)
  Top 0.305: v107.55,45.14 107.98,44.72 108.18,46.23 108.72,46
  Top 0.61: 108.72,46 Q10.1
  Bottom 0.305: 106.48,44.97 v107.55,45.14
  Bottom 0.406: R55.1 106.48,44.97
N$70  (via drill 0.3 pad 0.81)
  Top 0.406: Q6.1 119.5,45.92 v119.1,45.92
  Bottom 0.254: v119.1,45.92
  Bottom 0.406: R56.1 v119.1,45.92
N$76  (via drill 0.3 pad 0.81)
  Top 0.305: Q1.1 119.02,58.78 v119,58.8
  Bottom 0.254: R60.1 118.12,57.92
  Bottom 0.406: 118.12,57.92 v119,58.8
N$77  (via drill 0.3 pad 0.81)
  Top 0.305: v107.15,58.8 108.74,58.8
  Top 0.61: 108.74,58.8 Q4.1
  Bottom 0.254: R59.1 107.12,57.53
  Bottom 0.305: 107.11,58.8 v107.15,58.8
  Bottom 0.406: 107.12,57.53 v107.15,58.8
  Bottom 0.61: v107.15,58.8 107.19,58.8
N$79
  Top 1.778: C105.2 R85.1
N$82
  Top 0.305: L11.2 72.77,20.27 R87.2
  Bottom 0.305: C108.1 R87.2
N$86
  Top 1.778: C106.2 R86.1
N$87  (via drill 0.3)
  Top 0.305: IC1.35 52.9,36.57 54.1,35.37 62.6,35.37 69.8,28.17 v71.7,28.17 R91.2
  Bottom 0.406: R90.1 71.7,29.02 | 71.7,29.02 R89.1 | 71.7,29.02 v71.7,28.17 71.7,27.22 C109.1
PE  (6 unrouted)
  Top 2.184: 3.6,94.47 7.7,98.57 79.1,98.57 | 79.1,98.57 139.99,98.57 | 157.2,94.47 153.1,98.57 139.99,98.57 | 79.1,98.33 79.1,98.57 | 139.99,98.57 139.57,98 | 3.5,5.57 7.34,1.73 79.14,1.73 | 79.14,1.73 139.58,1.71 | 139.58,1.71 153.34,1.71 157.2,5.57 | 79.14,6.13 79.14,1.73 | 139.58,6.09 139.58,1.71
  Bottom 0.406: C110.2 158.23,79.52 R93.2 158.23,83.88 R92.1
  Bottom 1.676: R78.1 69.24,3.92 69.24,1.73 | R77.2 75.11,1.78 74.06,1.73
  Bottom 2.184: 72.12,1.73 69.24,1.73 7.39,1.73 J2.S4 | 72.12,1.73 74.06,1.73 79.12,1.73 | 139.61,1.71 153.39,1.73 J2.S3 158.62,6.96 158.62,10.64 | 79.12,1.73 139.61,1.71 | 72.12,1.73 72.05,3.9 | 79.12,1.73 H1.B2,5 | H4.B2,5 139.57,3.38 139.61,1.71 | 158.62,10.64 158.62,93.04 157.23,94.44 J2.S2 153.16,98.53 7.62,98.53 J2.S1 | J2.Z32 158.62,10.64
PGND  (1 unrouted)
  pour Bottom (isolate 0.61, rank 3, no thermals): 146.46,3.71 143.07,3.71 143.07,5.99 arc90 139.63,9.56 139.55,9.56 arc90 136.03,5.99 136.03,3.86 81.27,3.85 81.01,3.86 81.08,15.25 81,16.71 81.02,16.75 81.02,19.45 78.9,19.37 78.3,19.87 78.34,65.1 83.98,70.81 136.42,70.77 145.66,61.46 145.66,51.2 147.48,49.39 156.61,49.39 156.63,47.87 156.63,10.99 149.35,3.71
RXD
  Top 0.305: IC1.9 43.1,48.27 39.3,52.07 39.3,63.57 38.7,64.18 IC7.1 37.33,65.4 R8.1
SENSE1  (via drill 0.5)
  other vias: 125.9,34.17 127.5,34.17 129.1,34.17 125.9,32.57 127.5,32.57 129.1,32.57 126.7,33.37 128.3,33.37 125.9,21.47 127.5,21.47 129.1,21.47 125.9,19.87 127.5,19.87 129.1,19.87 126.7,20.67 128.3,20.67
  pour Top (isolate 0.508, no thermals): 124.21,32.13 129.55,32.13 129.55,34.73 124.19,34.73 124.21,34.34
  pour Top (isolate 0.508, no thermals): 124.13,19.33 129.55,19.33 129.55,21.97 124.16,21.97 124.13,21.54
  pour Bottom (isolate 0.406, rank 2, no thermals): 129.5,34.67 129.5,19.47 124.2,19.47 124.2,34.67
SENSE2  (via drill 0.5)
  other vias: 125.9,46.97 127.5,46.97 129.1,46.97 125.9,45.37 127.5,45.37 129.1,45.37 126.7,46.17 128.3,46.17 125.9,59.77 127.5,59.77 129.1,59.77 125.9,58.17 127.5,58.17 129.1,58.17 126.7,58.97 128.3,58.97
  pour Top (isolate 0.508, no thermals): 124.28,57.73 129.52,57.73 129.52,60.23 124.97,60.23 124.28,60.24
  pour Top (isolate 0.508, no thermals): 125.38,44.93 129.55,44.93 129.55,47.4 124.32,47.4 124.28,47.37 124.28,44.97 125.4,44.97
  pour Bottom (isolate 0.406, rank 2, no thermals): 129.5,60.17 129.5,44.97 124.3,44.97 124.3,60.17
SGND  (via drill 1 pad 2.18)
  Bottom 0.813: L3.1 v72.06,10.43 72.1,10.47 72.1,11.5 L10.2
  Bottom 1.676: R77.1 74.63,7.8 73.07,7.98 72.11,7.98 C28.2 | R78.2 69.33,7.9 C28.2 | C28.2 v72.06,10.43
STEP/ENC_A_N  (via drill 0.3)  (3 unrouted)
  Top 0.254: IC15.1 67.6,66.81 R79.2 67.64,66.46 68.42,66.46 68.78,66.1 73.92,66.1 89.32,81.5 105.58,81.5 105.9,81.17 v108.9,81.17 109.4,81.17 109.72,81.5 127.68,81.5 134.28,74.9 143.58,74.9 150.62,67.86 150.62,67.49 149.66,66.52 J2.D10
  Bottom 0.254: D8.3 108.3,81.18 108.3,81.27 | C93.1 149.61,68 J2.D10
  Bottom 0.61: 108.3,81.17 109.5,81.17
STEP/ENC_A_P  (via drill 0.3)
  Top 0.254: IC15.2 68.5,67.7 R79.1 68.81,66.86 69.02,66.65 73.68,66.65 89.08,82.05 105.48,82.05 105.8,82.37 v106.4,82.37 109.5,82.37 109.82,82.05 128.02,82.05 134.62,75.45 143.82,75.45 151.18,68.09 151.18,67.49 J2.B10
  Bottom 0.254: D8.1 105.76,82.22 105.7,82.27 105.8,82.27 105.9,82.37 | 107,82.37 107,81.77 D8.2 | C88.1 152.15,68.03 J2.B10
  Bottom 0.61: 105.8,82.37 105.9,82.37 v106.4,82.37 107,82.37
STEP_CLK  (via drill 0.3)  (2 unrouted)
  Top 0.254: R25.2 63.9,40.37 v65.1,41.57 | 69.73,56.74 v70.9,55.57 71.03,55.57 R34.1
  Bottom 0.254: 65,41.47 v65.1,41.57 67.15,43.62 66.4,44.37 66.4,51.05 v70.9,55.57 70.83,55.7
STEP_DIR  (via drill 0.3)  (2 unrouted)
  Top 0.254: 70.29,54.44 R32.1 71.4,53.29 v71.4,53.27
  Top 0.305: R24.2 v64.2,42.37 | v65.5,48.57 65.6,48.58 v67.28,48.58
  Bottom 0.254: 67.28,48.09 v67.28,48.58 67.28,51.06 69.5,53.27 v71.4,53.27
  Bottom 0.305: v64.2,42.37 65.5,43.67 v65.5,48.57
STEP_ENA  (via drill 0.3)  (1 unrouted)
  Top 0.305: IC1.11 41.5,47.27 v41.1,47.67 | 52.85,58.92 v51.7,57.77 51.7,57.61 R36.1
  Bottom 0.305: v41.1,47.67 43.4,49.97 47.4,49.97 49.4,51.97 49.4,55.44 51.7,57.74 v51.7,57.77
STEP_SYNC  (via drill 0.3)  (1 unrouted)
  Top 0.305: 51.95,59.82 v50.9,58.77 50.3,58.18 R38.1
  Bottom 0.305: v63.3,41.37 63.3,42.77 64.6,44.07 64.6,48.07 53.9,58.77 v50.9,58.77
SYNC/ENC_I_N  (via drill 0.3)  (1 unrouted)
  Top 0.254: R81.2 62.59,73.61 IC15.15 62.27,73.93 62.27,74.41 61.82,74.86 61.82,78.99 65.78,82.95 71.12,82.95 73.72,80.35 81.08,80.35 87.88,87.15 123.28,87.15 123.6,87.47 v124.1,87.47 127.2,87.47 127.52,87.15 130.22,87.15 137.32,80.05 144.08,80.05 148.58,84.55 150.22,84.55 151.18,83.59 151.18,82.67 152.05,81.81 J2.B4
  Bottom 0.254: C99.1 152.15,83.26 J2.B4 | D6.2 124.7,86.92 124.7,87.47 | D6.1 123.5,86.95 123.5,87.37
  Bottom 0.61: 123.5,87.47 v124.1,87.47 124.7,87.47
SYNC/ENC_I_P  (via drill 0.3)  (1 unrouted)
  Top 0.254: R81.1 63.52,74.48 IC15.14 63.21,74.79 62.69,74.79 62.38,75.09 62.38,78.76 66.02,82.4 70.88,82.4 73.48,79.8 81.32,79.8 88.12,86.6 123.28,86.6 123.6,86.27 v126.7,86.27 127.2,86.27 127.52,86.6 129.98,86.6 137.08,79.5 144.32,79.5 148.82,84 149.98,84 150.62,83.36 150.62,82.67 149.71,81.76 J2.D4
  Bottom 0.254: C98.1 149.61,83.2 J2.D4 | D6.4 127.25,86.32 | D6.3 126.1,86.79 126.1,86.27
  Bottom 0.61: 126,86.27 126.1,86.27 v126.7,86.27 127.2,86.27
TXD
  Top 0.305: IC1.10 42.3,48.07 38.6,51.77 38.6,58.37 37.32,59.65 IC7.4
VBUS  (2 unrouted)
  Top 0.305: R91.1 79.4,27.17
  Bottom 1.676: R1.1 J2.Z28
  Bottom 1.93: 88.37,10.61 C25.+ C76.1 | C79.1 98.97,10.69 C80.+ | C2.1 109.59,10.62 C78.+ | C3.1 120.03,10.72 C77.+
  pour Top (isolate 0.508, rank 3, no thermals): 78.41,9.57 78.39,62.46 86.62,70.69 106.15,70.69 106.15,18.42 129.91,18.42 130.1,18.57 131.39,19.86 134.69,23.19 155.81,23.19 158.33,20.73 158.39,11.61 150.61,3.7 143.01,3.68 143.01,5.97 arc90 139.67,9.52 139.59,9.52 arc90 136.09,5.99 136.09,3.8 82.63,3.8 82.63,5.99 arc90 79.32,9.58
VEE  (via drill 0.4 pad 0.81)  (5 unrouted)
  Top 0.305: 61.19,69.91 61.21,69.91 | C66.1 62.74,71.43 IC15.16
  Top 0.406: 65.24,63.08 65.24,63.4 v65.22,67.13 | IC15.4 70,69.8 v70.25,69.47 | DZ1.OA 9.18,84.47 9.16,90.15 13.3,94.25 58.7,94.27 60.7,92.27 60.7,73.87 59.2,72.37 59.2,71.17 60.47,69.91 61.19,69.91
  Bottom 0.406: v65.22,67.13 67.56,69.47 v70.25,69.47
  pour Top (isolate 0.305, no thermals): 59.2,71.97 53.7,66.47 53.7,63.67 59.8,57.57 64.8,57.57 69.5,62.27 75.9,62.27 86.7,73.07 93.8,73.07 93.8,75.57 92,77.37 86.8,77.37 74.5,65.07 68.4,65.07 61.9,71.57 60.8,70.47 60.7,70.47